# Altium project CMC_400.PrjPcb
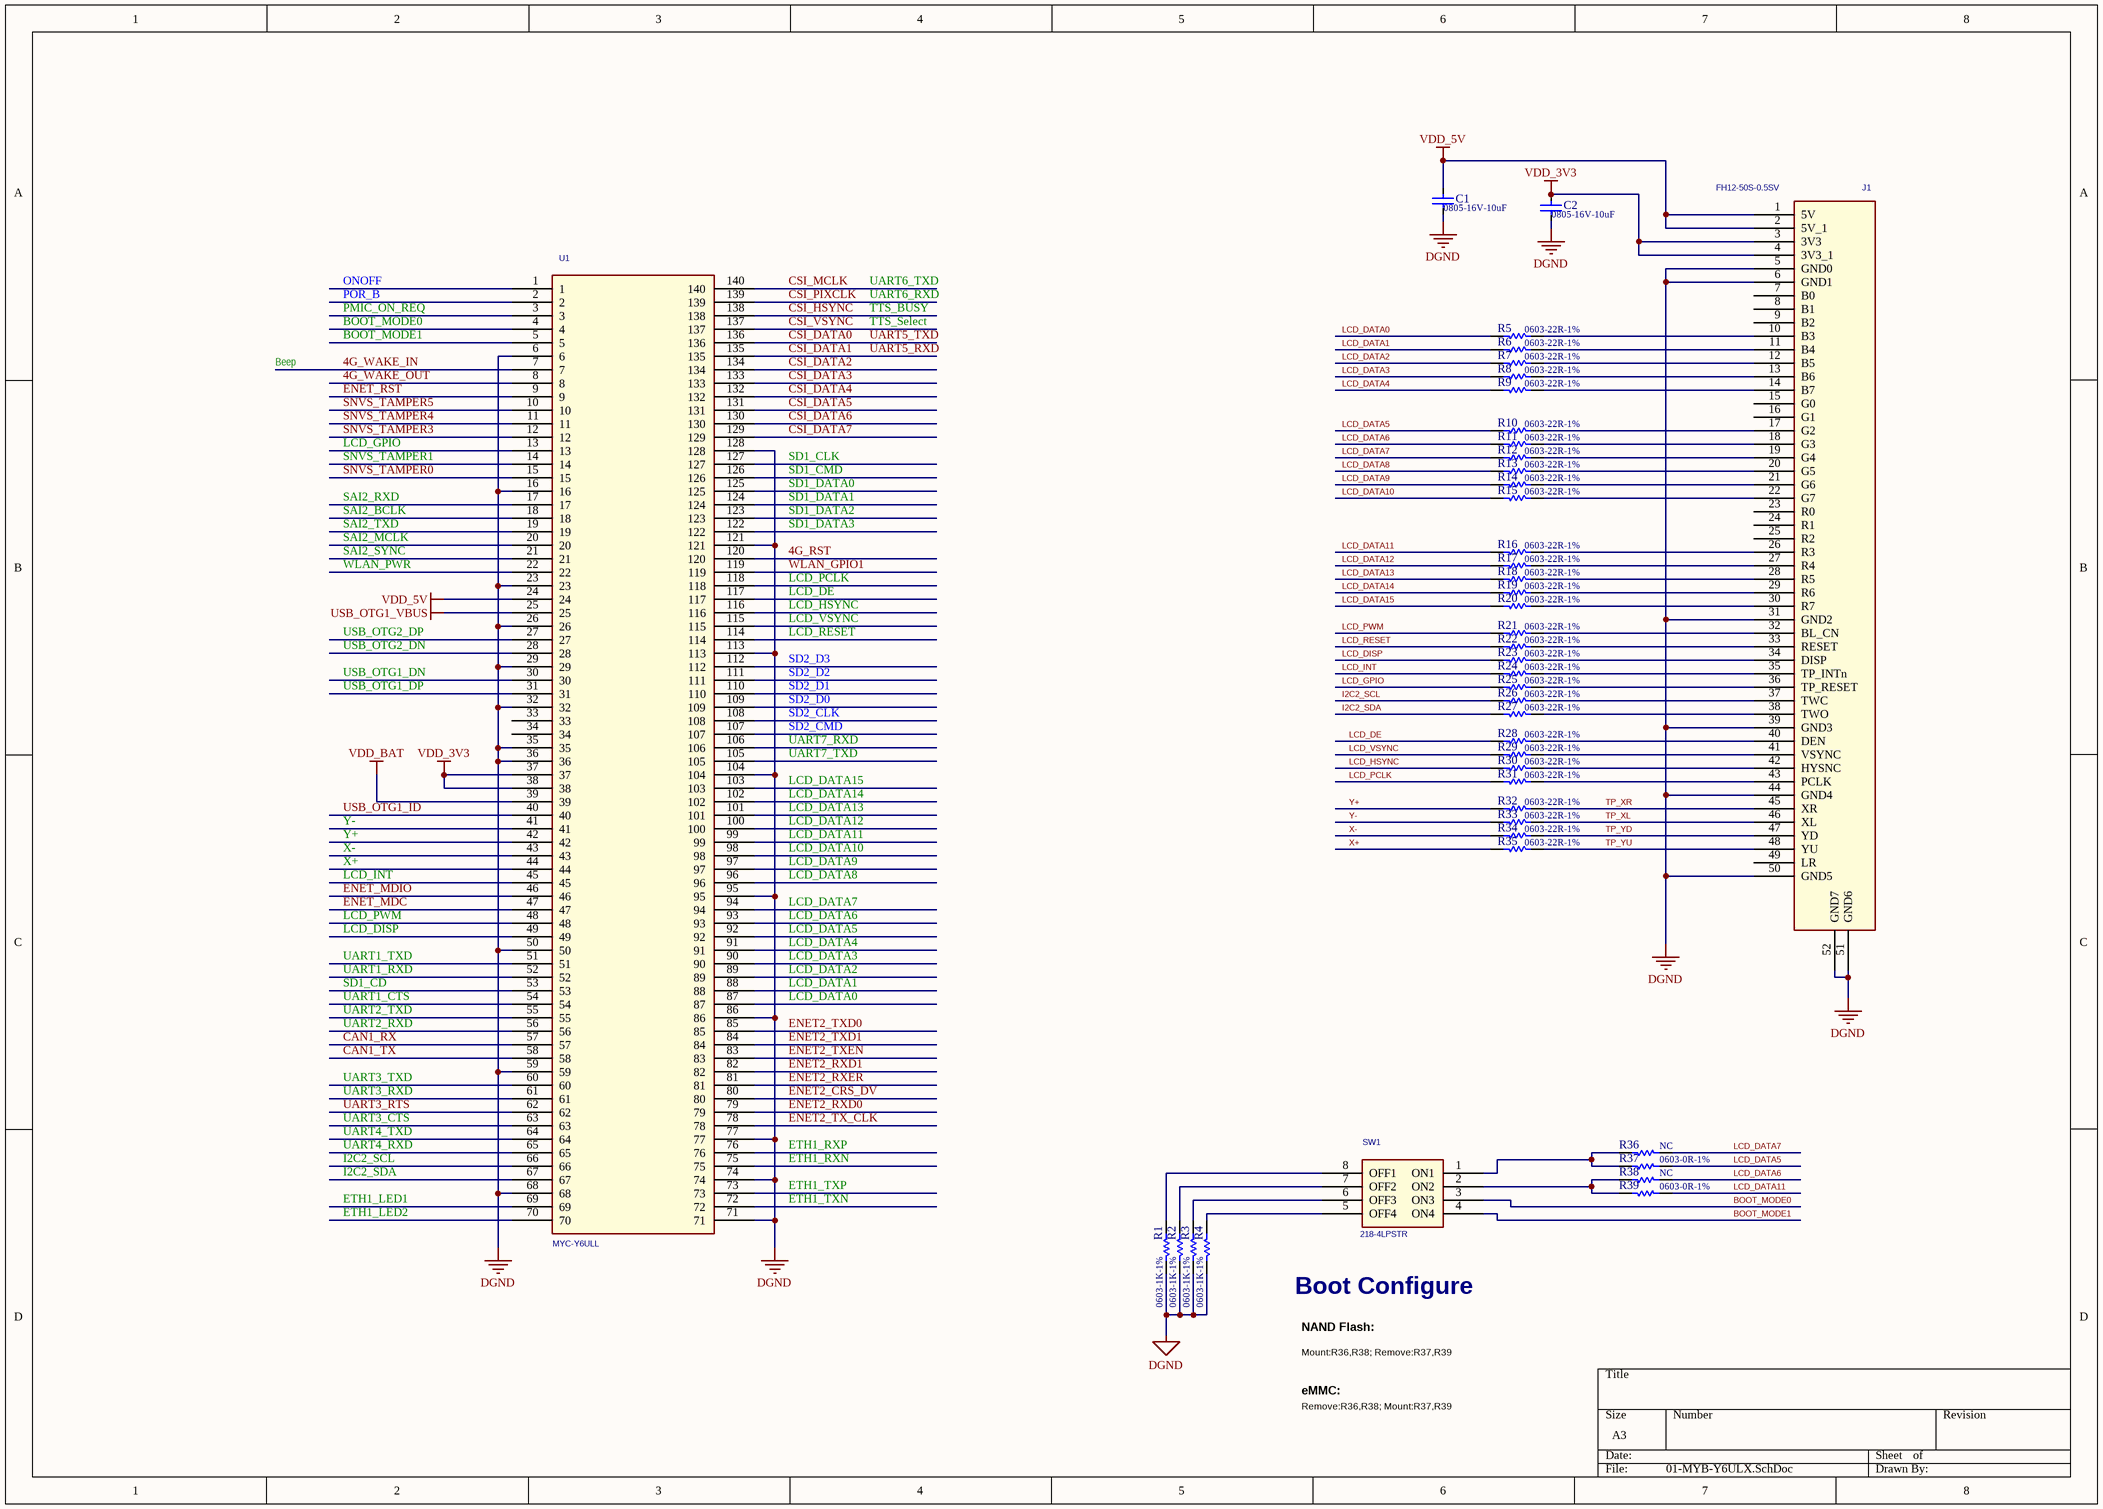
[diagram p0: 01-MYB-Y6ULX.SchDoc]
9 sheets, 334 parts. Net scope: global (net labels, ports and power ports of the same name join across sheets).
Sheets:
  01-MYB-Y6ULX.SchDoc
  02-PowerIn.SchDoc
  03-power.SchDoc
  04-MCU.SchDoc
  05-UART.SchDoc
  06-Audio.SchDoc
  07-NET.SchDoc
  08-USB&TF.SchDoc
  09-other.SchDoc

## Sheet 01-MYB-Y6ULX.SchDoc
size A3

### Parts
C1  0805-16V-10uF  [0805C - 3D]
C2  0805-16V-10uF  [0805C - 3D]
J1  FH12-50S-0.5SV  [fpc50-1_0-v]
R1  0603-1K-1%  [0603R]
R2  0603-1K-1%  [0603R]
R3  0603-1K-1%  [0603R]
R4  0603-1K-1%  [0603R]
R5  0603-22R-1%  [0603R]
R6  0603-22R-1%  [0603R]
R7  0603-22R-1%  [0603R]
R8  0603-22R-1%  [0603R]
R9  0603-22R-1%  [0603R]
R10  0603-22R-1%  [0603R]
R11  0603-22R-1%  [0603R]
R12  0603-22R-1%  [0603R]
R13  0603-22R-1%  [0603R]
R14  0603-22R-1%  [0603R]
R15  0603-22R-1%  [0603R]
R16  0603-22R-1%  [0603R]
R17  0603-22R-1%  [0603R]
R18  0603-22R-1%  [0603R]
R19  0603-22R-1%  [0603R]
R20  0603-22R-1%  [0603R]
R21  0603-22R-1%  [0603R]
R22  0603-22R-1%  [0603R]
R23  0603-22R-1%  [0603R]
R24  0603-22R-1%  [0603R]
R25  0603-22R-1%  [0603R]
R26  0603-22R-1%  [0603R]
R27  0603-22R-1%  [0603R]
R28  0603-22R-1%  [0603R]
R29  0603-22R-1%  [0603R]
R30  0603-22R-1%  [0603R]
R31  0603-22R-1%  [0603R]
R32  0603-22R-1%  [0603R]
R33  0603-22R-1%  [0603R]
R34  0603-22R-1%  [0603R]
R35  0603-22R-1%  [0603R]
R36  NC  [0603R]
R37  0603-0R-1%  [0603R]
R38  NC  [0603R]
R39  0603-0R-1%  [0603R]
SW1  218-4LPSTR  [sw-1x4]
U1  MYC-Y6ULL  [YOUPK37X39_1_00-SMD]

### Nets
DGND: C1.2 C2.2 J1.5(GND0) J1.6(GND1) J1.31(GND2) J1.39(GND3) J1.44(GND4) J1.50(GND5) J1.51(GND6) J1.52(GND7) R1.1 R2.1 R3.1 R4.1 U1.6 U1.16 U1.23 U1.26 U1.29 U1.32 U1.35 U1.36 U1.50 U1.59 U1.68 U1.71 U1.74 U1.77 U1.86 U1.95 U1.104 U1.113 U1.121 U1.128
USB_OTG1_VBUS: U1.25
VDD_3V3: C2.1 J1.3(3V3) J1.4(3V3_1) U1.37 U1.38
VDD_5V: C1.1 J1.1(5V) J1.2(5V_1) U1.24
VDD_BAT: U1.39
4G_RST: U1.120
4G_WAKE_IN: U1.7  [also labelled Beep]
4G_WAKE_OUT: U1.8
BOOT_MODE0: SW1.3(ON3) U1.4
BOOT_MODE1: SW1.4(ON4) U1.5
CAN1_RX: U1.57
CAN1_TX: U1.58
CSI_DATA0: U1.136  [also labelled UART5_TXD]
CSI_DATA1: U1.135  [also labelled UART5_RXD]
CSI_DATA2: U1.134
CSI_DATA3: U1.133
CSI_DATA4: U1.132
CSI_DATA5: U1.131
CSI_DATA6: U1.130
CSI_DATA7: U1.129
CSI_HSYNC: U1.138  [also labelled TTS_BUSY]
CSI_MCLK: U1.140  [also labelled UART6_TXD]
CSI_PIXCLK: U1.139  [also labelled UART6_RXD]
CSI_VSYNC: U1.137  [also labelled TTS_Select]
ENET2_CRS_DV: U1.80
ENET2_RXD0: U1.79
ENET2_RXD1: U1.82
ENET2_RXER: U1.81
ENET2_TX_CLK: U1.78
ENET2_TXD0: U1.85
ENET2_TXD1: U1.84
ENET2_TXEN: U1.83
ENET_MDC: U1.47
ENET_MDIO: U1.46
ENET_RST: U1.9
ETH1_LED1: U1.69
ETH1_LED2: U1.70
ETH1_RXN: U1.75
ETH1_RXP: U1.76
ETH1_TXN: U1.72
ETH1_TXP: U1.73
I2C2_SCL: R26.1 U1.66
I2C2_SDA: R27.1 U1.67
LCD_DATA0: R5.1 U1.87
LCD_DATA1: R6.1 U1.88
LCD_DATA2: R7.1 U1.89
LCD_DATA3: R8.1 U1.90
LCD_DATA4: R9.1 U1.91
LCD_DATA5: R10.1 R37.2 U1.92
LCD_DATA6: R11.1 R38.2 U1.93
LCD_DATA7: R12.1 R36.2 U1.94
LCD_DATA8: R13.1 U1.96
LCD_DATA9: R14.1 U1.97
LCD_DATA10: R15.1 U1.98
LCD_DATA11: R16.1 R39.2 U1.99
LCD_DATA12: R17.1 U1.100
LCD_DATA13: R18.1 U1.101
LCD_DATA14: R19.1 U1.102
LCD_DATA15: R20.1 U1.103
LCD_DE: R28.1 U1.117
LCD_DISP: R23.1 U1.49
LCD_GPIO: R25.1 U1.13
LCD_HSYNC: R30.1 U1.116
LCD_INT: R24.1 U1.45
LCD_PCLK: R31.1 U1.118
LCD_PWM: R21.1 U1.48
LCD_RESET: R22.1 U1.114
LCD_VSYNC: R29.1 U1.115
ONOFF: U1.1
PMIC_ON_REQ: U1.3
POR_B: U1.2
SAI2_BCLK: U1.18
SAI2_MCLK: U1.20
SAI2_RXD: U1.17
SAI2_SYNC: U1.21
SAI2_TXD: U1.19
SD1_CD: U1.53
SD1_CLK: U1.127
SD1_CMD: U1.126
SD1_DATA0: U1.125
SD1_DATA1: U1.124
SD1_DATA2: U1.123
SD1_DATA3: U1.122
SD2_CLK: U1.108
SD2_CMD: U1.107
SD2_D0: U1.109
SD2_D1: U1.110
SD2_D2: U1.111
SD2_D3: U1.112
SNVS_TAMPER0: U1.15
SNVS_TAMPER1: U1.14
SNVS_TAMPER3: U1.12
SNVS_TAMPER4: U1.11
SNVS_TAMPER5: U1.10
TP_XL: J1.46(XL) R33.2
TP_XR: J1.45(XR) R32.2
TP_YD: J1.47(YD) R34.2
TP_YU: J1.48(YU) R35.2
UART1_CTS: U1.54
UART1_RXD: U1.52
UART1_TXD: U1.51
UART2_RXD: U1.56
UART2_TXD: U1.55
UART3_CTS: U1.63
UART3_RTS: U1.62
UART3_RXD: U1.61
UART3_TXD: U1.60
UART4_RXD: U1.65
UART4_TXD: U1.64
UART7_RXD: U1.106  [project net MCU_TX]
UART7_TXD: U1.105  [project net MCU_RX]
USB_OTG1_DN: U1.30
USB_OTG1_DP: U1.31
USB_OTG1_ID: U1.40
USB_OTG2_DN: U1.28
USB_OTG2_DP: U1.27
WLAN_GPIO1: U1.119
WLAN_PWR: U1.22
X+: R35.1 U1.44
X-: R34.1 U1.43
Y+: R32.1 U1.42
Y-: R33.1 U1.41
NetJ1_10: J1.10(B3) R5.2
NetJ1_11: J1.11(B4) R6.2
NetJ1_12: J1.12(B5) R7.2
NetJ1_13: J1.13(B6) R8.2
NetJ1_14: J1.14(B7) R9.2
NetJ1_17: J1.17(G2) R10.2
NetJ1_18: J1.18(G3) R11.2
NetJ1_19: J1.19(G4) R12.2
NetJ1_20: J1.20(G5) R13.2
NetJ1_21: J1.21(G6) R14.2
NetJ1_22: J1.22(G7) R15.2
NetJ1_26: J1.26(R3) R16.2
NetJ1_27: J1.27(R4) R17.2
NetJ1_28: J1.28(R5) R18.2
NetJ1_29: J1.29(R6) R19.2
NetJ1_30: J1.30(R7) R20.2
NetJ1_32: J1.32(BL_CN) R21.2
NetJ1_33: J1.33(RESET) R22.2
NetJ1_34: J1.34(DISP) R23.2
NetJ1_35: J1.35(TP_INTn) R24.2
NetJ1_36: J1.36(TP_RESET) R25.2
NetJ1_37: J1.37(TWC) R26.2
NetJ1_38: J1.38(TWO) R27.2
NetJ1_40: J1.40(DEN) R28.2
NetJ1_41: J1.41(VSYNC) R29.2
NetJ1_42: J1.42(HYSNC) R30.2
NetJ1_43: J1.43(PCLK) R31.2
NetR1_2: R1.2 SW1.8(OFF1)
NetR2_2: R2.2 SW1.7(OFF2)
NetR3_2: R3.2 SW1.6(OFF3)
NetR4_2: R4.2 SW1.5(OFF4)
NetR36_1: R36.1 R37.1 SW1.1(ON1)
NetR38_1: R38.1 R39.1 SW1.2(ON2)

Not connected (* = marked no-connect by the designer): J1 7(B0) 8(B1) 9(B2) 15(G0) 16(G1) 23(R0) 24(R1) 25(R2) 49(LR); U1 33 34

### Notes on the sheet
- Boot Configure
- eMMC:
- NAND Flash:
- Mount:R36,R38; Remove:R37,R39
- Remove:R36,R38; Mount:R37,R39

### Library data of the parts
C1 C2 = Cap: Capacitor; Value: 10nF; Published: 8-Jun-2000; Revision: July-2002: Re-released for DXP Platform.; Publisher: Altium Limited
J1 = FPC50: FPC Connector,Straight,50Pin,0.5mm Pitch  Flip Vertical  Type ,2MM Height,Tin Plated, white,SMD; Manufacturer: HRS; Myir P/N: 2110600006; Datasheet: FH12_30s-fpc.pdf; Reserve Value: FH12-50S-0.5SV; Manufacturer P/N: FH12-50S-0.5SV; Part Type: Connector
R1-R35 R37 R39 = Res1: Resistor; Value: 1K; Published: 8-Jun-2000; LatestRevisionDate: 17-Jul-2002; LatestRevisionNote: Re-released for DXP Platform.; PackageReference: AXIAL-0.3; Publisher: Altium Limited
R36 R38 = Res1: Resistor; Value: 0603-0R-1%; Published: 8-Jun-2000; LatestRevisionDate: 17-Jul-2002; LatestRevisionNote: Re-released for DXP Platform.; PackageReference: AXIAL-0.3; Publisher: Altium Limited
SW1 = SWITCH-4: Switch, Dip Switches SPST 4 switch sections,4 Position,1.27MM Pitch,black housing,white plunger,SMD,CTS; Myir P/N: 2120300002; Datasheet: 218-786217.pdf; Reserve Value: 218-4LPSTR; Manufacturer P/N: 218-4LPSTR; Manufacturer: CTS; Part Type: Switch
U1 = AM335X_QFN_2

## Sheet 02-PowerIn.SchDoc
size A4
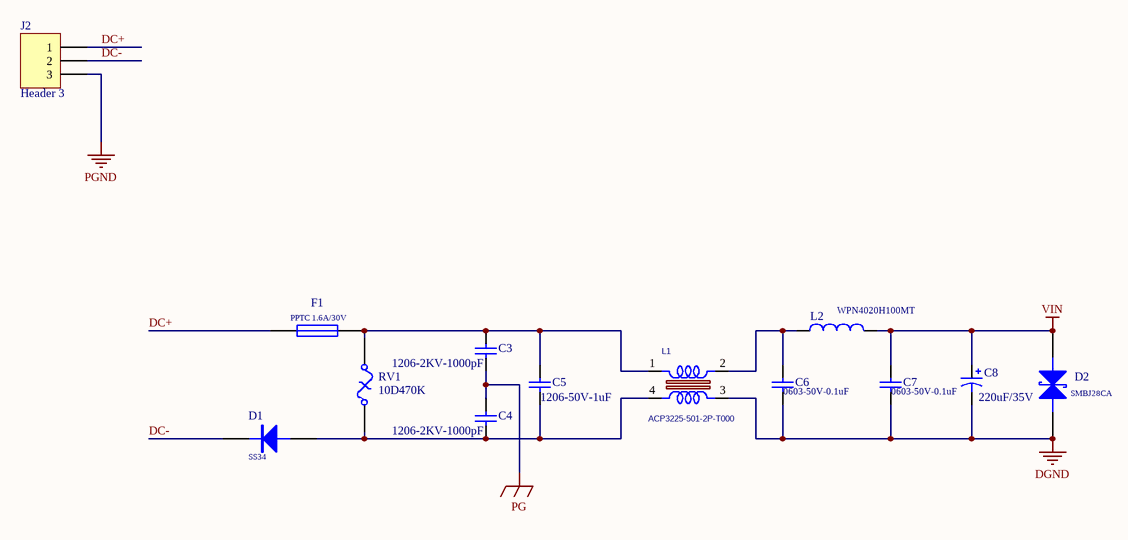
[diagram p1: 02-PowerIn.SchDoc]

### Parts
C3  1206-2KV-1000pF  [1206C]
C4  1206-2KV-1000pF  [1206C]
C5  1206-50V-1uF  [1206C]
C6  0603-50V-0.1uF  [0603C]
C7  0603-50V-0.1uF  [0603C]
C8  value 220uF/35V  [CAP-D8.0XH10.5]  (hidden comment: CK1V221MCRF10)
D1  SS34  [SMA]
D2  SMBJ28CA  [SMB-TVS]
F1  PPTC 1.6A/30V  [F-1.60A-30V]
J2  Header 3  [KF2EDGR-5.08-3P]
L1  ACP3225-501-2P-T000  [1210_4P]
L2  WPN4020H100MT  [4012]
RV1  10D470K  [PS-RES-12.5*5.4]

### Nets
DGND: C6.2 C7.2 C8.2 D2.1(A) L1.3
PG: C3.1 C4.2
PGND: J2.3
VIN: C7.1 C8.1 D2.2(K) L2.2
DC+: F1.2 J2.1
DC-: D1.2 J2.2
NetC3_2: C3.2 C5.2 F1.1 L1.1 RV1.2
NetC4_1: C4.1 C5.1 D1.1 L1.4 RV1.1
NetC6_1: C6.1 L1.2 L2.1

### Library data of the parts
C3-C5 = Cap: Capacitor; Published: 8-Jun-2000; LatestRevisionDate: 17-Jul-2002; LatestRevisionNote: Re-released for DXP Platform.; Publisher: Altium Limited
C6 C7 = Cap: Capacitor; Value: 10nF; Published: 8-Jun-2000; Revision: July-2002: Re-released for DXP Platform.; Publisher: Altium Limited
C8 = Cap Pol1: Polarized Capacitor (Radial); 厂家: ST(先科); 封装: SMD,8x10.5mm; Published: 8-Jun-2000; LatestRevisionDate: 17-Jul-2002; LatestRevisionNote: Re-released for DXP Platform.; PackageReference: RB7.6-15; Publisher: Altium Limited; PackageDescription: Polarized Capacitor (Radial); 2 Leads; 型号: CK1V221MCRF10
D1 = DIODE
D2 = TVSC
F1 = Fuse 1: Fuse; 型号: RL30-160; 厂家: RUILON(瑞隆源); Published: 8-Jun-2000; LatestRevisionDate: 17-Jul-2002; LatestRevisionNote: Re-released for DXP Platform.; PackageReference: PIN-W2/E2.8; Publisher: Altium Limited; PackageDescription: Thru-Hole; 2 Leads
J2 = Header 3: Header, 3-Pin; LatestRevisionDate: 17-Jul-2002; LatestRevisionNote: Re-released for DXP Platform.; Publisher: Altium Limited
L1 = Common Choke: Inductor, TDK,500ohm@100MHz,±25%,2A ,0.4ohm; Manufacturer: Sunlord; Manufacturer P/N: SDCW2012-2-121TF; Mfg2_PN: EXC-24CE201U; DNP: No; Device: 0504CHOKE; Mfg1_PN: DLP11SN900SL2; Dist1: Mouser; Mfg1: Murata; Dist1_PN: 81-DLP11SN900SL2L; Cost_1K: 0.26; Cost_100: 0.32; Myir P/N: 2050400001; Reserve Value: 120ohm; Mfg2: Panasonic; Cost: 0.56; Part Type: Common Inductor; Datasheet: SDCW2012-2.pdf
L2 = Inductor: 贴片功率电感; Code_IEC: 1005; Published: 8-Jun-2000; LatestRevisionDate: 29-May-2009; LatestRevisionNote: IPC-7351 Footprint Added.; PackageReference: 0402-A; Publisher: Altium Limited; PackageDescription: Chip Inductor; Code_JEITA: 0402
RV1 = Fuse Thermal: Thermal Fuse; Published: 24-Mar-1999; LatestRevisionDate: 17-Jul-2002; LatestRevisionNote: Re-released for DXP Platform.; PackageReference: PIN-W2/E2.8; Publisher: Altium Limited; PackageDescription: Thru-Hole; 2 Leads

## Sheet 03-power.SchDoc
size A4
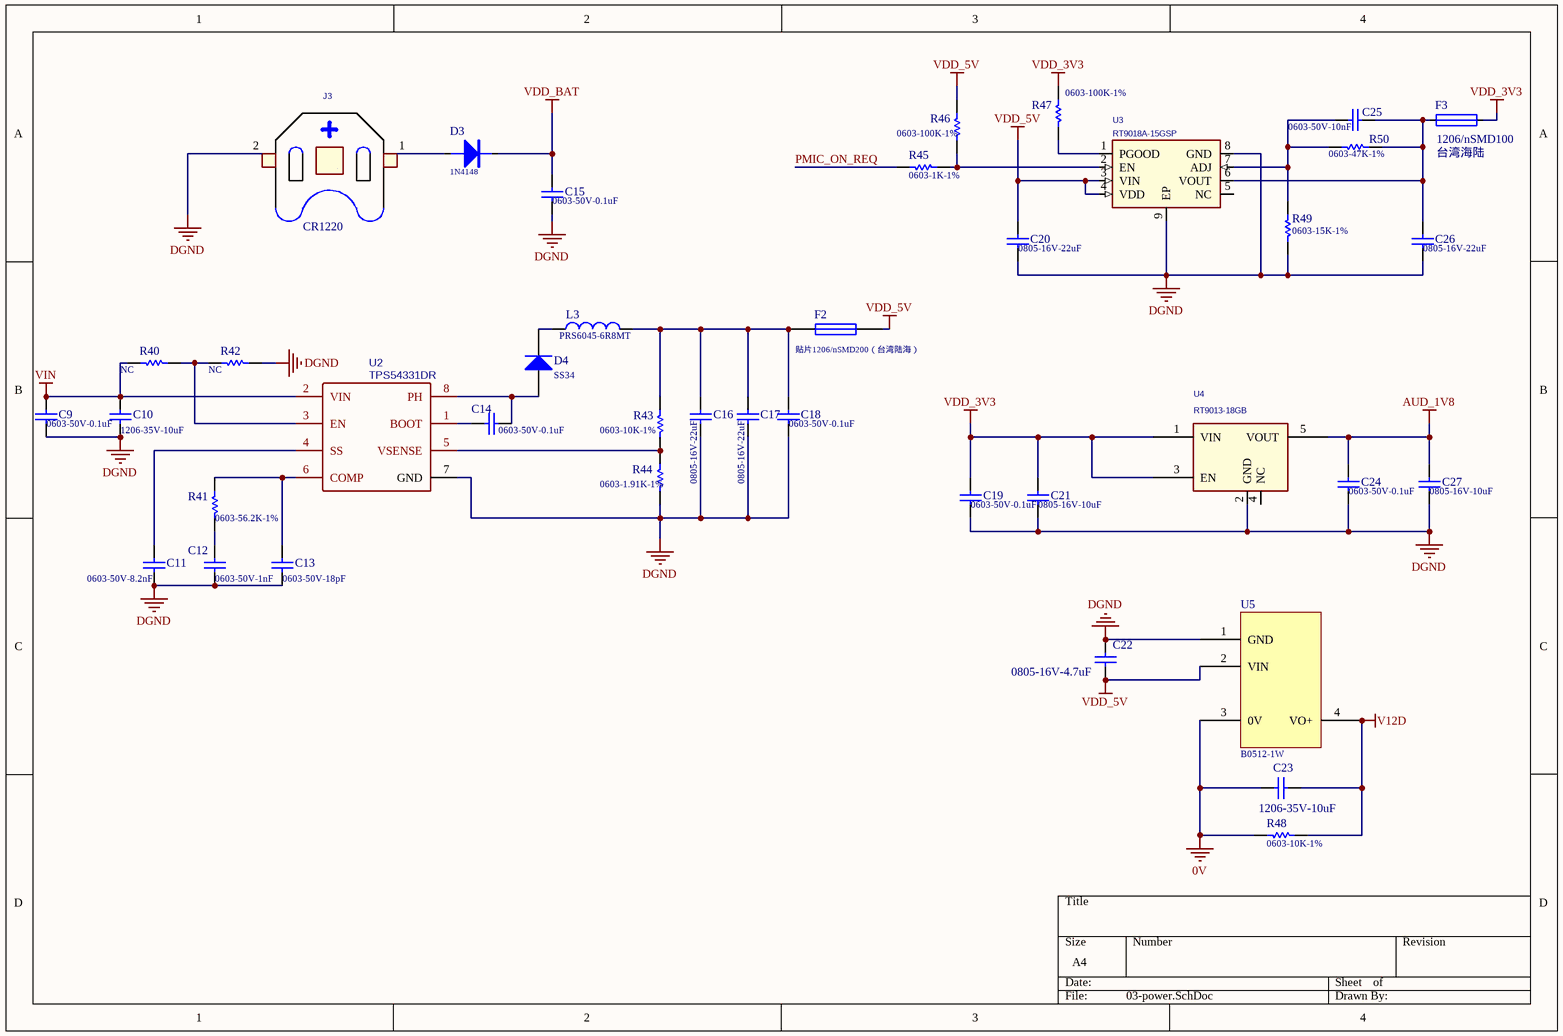
[diagram p2: 03-power.SchDoc]

### Parts
C9  0603-50V-0.1uF  [0603C]
C10  1206-35V-10uF  [1206C]
C11  0603-50V-8.2nF  [0603C]
C12  0603-50V-1nF  [0603C]
C13  0603-50V-18pF  [0603C]
C14  0603-50V-0.1uF  [0603C]
C15  0603-50V-0.1uF  [0603C]
C16  0805-16V-22uF  [0805C]
C17  0805-16V-22uF  [0805C]
C18  0603-50V-0.1uF  [0603C]
C19  0603-50V-0.1uF  [0603C]
C20  0805-16V-22uF  [0805C]
C21  0805-16V-10uF  [0805C]
C22  0805-16V-4.7uF  [1206C]
C23  1206-35V-10uF  [1206C]
C24  0603-50V-0.1uF  [0603C]
C25  0603-50V-10nF  [0603C]
C26  0805-16V-22uF  [0805C]
C27  0805-16V-10uF  [0805C]
D3  1N4148  [SOD-323]
D4  SS34  [SMA]
F2  贴片1206/nSMD200（台湾陆海）  [1206F]
F3  1206/nSMD100  厂家: 台湾海陆  [1206F]
J3  CR1220  [CR1220]
L3  PRS6045-6R8MT  [SCDS125T 12.5*12.5]
R40  NC  [0603R]
R41  0603-56.2K-1%  [0603R]
R42  NC  [0603R]
R43  0603-10K-1%  [0603R]
R44  0603-1.91K-1%  [0603R]
R45  0603-1K-1%  [0603R]
R46  0603-100K-1%  [0603R]
R47  0603-100K-1%  [0603R]
R48  0603-10K-1%  [0603R]
R49  0603-15K-1%  [0603R]
R50  0603-47K-1%  [0603R]
U2  TPS54331DR  [LC-SOIC-8_150mil]
U3  RT9018A-15GSP  [LC-SOP-8_EP_150mil]
U4  RT9013-18GB  [SOT-23-5]
U5  B0512-1W  [DIP-11.6X6.0X10.16]

### Nets
0V: C23.2 R48.1 U5.3(0V)
AUD_1V8: C24.1 C27.1 U4.5(VOUT)
DGND: C9.2 C10.2 C11.2 C12.2 C13.2 C15.2 C16.2 C17.2 C18.2 C19.2 C20.2 C21.2 C22.2 C24.2 C26.2 C27.2 J3.2(P2) R42.2 R44.2 R49.1 U2.7(GND) U3.8(GND) U3.9(EP) U4.2(GND) U5.1(GND)
V12D: C23.1 R48.2 U5.4(VO+)
VDD_3V3: C19.1 C21.1 F3.1 R47.1 U4.1(VIN) U4.3(EN)
VDD_5V: C20.1 C22.1 F2.2 R46.1 U3.3(VIN) U3.4(VDD) U5.2(VIN)
VDD_BAT: C15.1 D3.2
VIN: C9.1 C10.1 R40.1 U2.2(VIN)
PMIC_ON_REQ: R45.1
NetC11_1: C11.1 U2.4(SS)
NetC12_1: C12.1 R41.2
NetC13_1: C13.1 R41.1 U2.6(COMP)
NetC14_1: C14.1 D4.1(A) U2.8(PH)
NetC14_2: C14.2 U2.1(BOOT)
NetC16_1: C16.1 C17.1 C18.1 F2.1 L3.2 R43.1
NetC25_1: C25.1 R49.2 R50.1 U3.7(ADJ)
NetC25_2: C25.2 C26.1 F3.2 R50.2 U3.6(VOUT)
NetD3_1: D3.1 J3.1(P1)
NetD4_2: D4.2(K) L3.1
NetR40_2: R40.2 R42.1 U2.3(EN)
NetR43_2: R43.2 R44.1 U2.5(VSENSE)
NetR45_2: R45.2 R46.2 U3.2(EN)
NetR47_2: R47.2 U3.1(PGOOD)

Not connected (* = marked no-connect by the designer): U3 5(NC); U4 4(NC)

### Library data of the parts
C9-C21 C24-C27 = Cap: Capacitor; Value: 10nF; Published: 8-Jun-2000; Revision: July-2002: Re-released for DXP Platform.; Publisher: Altium Limited
C22 = Cap: Capacitor; Value: 2.2u; Published: 8-Jun-2000; LatestRevisionDate: 17-Jul-2002; LatestRevisionNote: Re-released for DXP Platform.; PackageReference: RAD-0.3; Publisher: Altium Limited; PackageDescription: Radial Cap, Thru-Hole; 2 Leads; 0.3 in Pin Spacing
C23 = Cap: Capacitor; Value: 4.7u; Published: 8-Jun-2000; LatestRevisionDate: 17-Jul-2002; LatestRevisionNote: Re-released for DXP Platform.; PackageReference: RAD-0.3; Publisher: Altium Limited; PackageDescription: Radial Cap, Thru-Hole; 2 Leads; 0.3 in Pin Spacing
D3 = DIODE
D4 = Diode BAS16: Silicon Switching Diode for High-Speed Switching; Note: Pin 2 is not connected and not drawn.; Published: 21-Mar-2003; LatestRevisionDate: 29-May-2009; LatestRevisionNote: IPC-7351 Footprint Added.; DatasheetVersion: Oct-1999; PackageVersion: Sep-2001; PackageReference: SOT-23; Publisher: Altium Limited; PackageDescription: 3-Pin SOT-23 Package 0.95 mm Pitch, 2.5 mm Lead Span; ComponentLink1Description: Manufacturer Link; ComponentLink1URL: http://www.infineon.com/; ComponentLink2Description: Datasheet; ComponentLink2URL: http://www.infineon.com/upload/Document/cmc_upload/documents/012/5331/bas16series.pdf
F2 F3 = Fuse 1: Fuse; Published: 8-Jun-2000; LatestRevisionDate: 17-Jul-2002; LatestRevisionNote: Re-released for DXP Platform.; PackageReference: PIN-W2/E2.8; Publisher: Altium Limited; PackageDescription: Thru-Hole; 2 Leads
J3 = BatteryHolder_1225: Connector,Battery Holder for 1225,Brown,SMD; Manufacturer: Leyconn; Manufacturer P/N: 469123330020; Myir P/N: 2111900002; Part Type: Connector; Reserve Value: CR1220; Datasheet: 469123-BatteryHolder_1225.pdf
L3 = Inductor: 贴片功率电感; Code_IEC: 1005; Published: 8-Jun-2000; LatestRevisionDate: 29-May-2009; LatestRevisionNote: IPC-7351 Footprint Added.; PackageReference: 0402-A; Publisher: Altium Limited; PackageDescription: Chip Inductor; Code_JEITA: 0402
R40 = Res1: Resistor; Value: 332K; Published: 8-Jun-2000; LatestRevisionDate: 17-Jul-2002; LatestRevisionNote: Re-released for DXP Platform.; PackageReference: AXIAL-0.3; Publisher: Altium Limited
R41 R43-R50 = Res1: Resistor; Value: 1K; Published: 8-Jun-2000; LatestRevisionDate: 17-Jul-2002; LatestRevisionNote: Re-released for DXP Platform.; PackageReference: AXIAL-0.3; Publisher: Altium Limited
R42 = Res1: Resistor; Value: 68.1K; Published: 8-Jun-2000; LatestRevisionDate: 17-Jul-2002; LatestRevisionNote: Re-released for DXP Platform.; PackageReference: AXIAL-0.3; Publisher: Altium Limited
U2 = (no symbol name): BOM_Manufacturer: TI; BOM_Supplier: LCSC; BOM_Manufacturer Part: TPS54331DR; BOM_LCSC Assembly: Yes; image: //image.lceda.cn/szlcsc/C9865.jpg; BOM_Supplier Part: C9865; spicePre: U
U3 = RT9018B: IC, Maximum 3A, Ultra Low Dropout Regulator 8SOP; Manufacturer: Richtek; Manufacturer P/N: RT9018A-18GSP; Myir P/N: 2010300061; Part Type: Power Management; Reserve Value: RT9018A-18GSP; Datasheet: RT9018.pdf
U4 = RT9013-18GB: IC, REG LDO 1.8V 0.5A SOT23-5; Manufacturer: Richtek; Myir P/N: 2010300012; Part Type: Power Management; Manufacturer P/N: RT9013-18GB; Reserve Value: RT9013-18GB; Datasheet: RT9013.pdf
U5 = F1212XT-1WR2: 隔离电源; 型号: B0512S-1W; 厂家: 清远市特斯拉电子科技有限公司; 替带产品: 金升阳  B0512S-1W

## Sheet 04-MCU.SchDoc
size A3
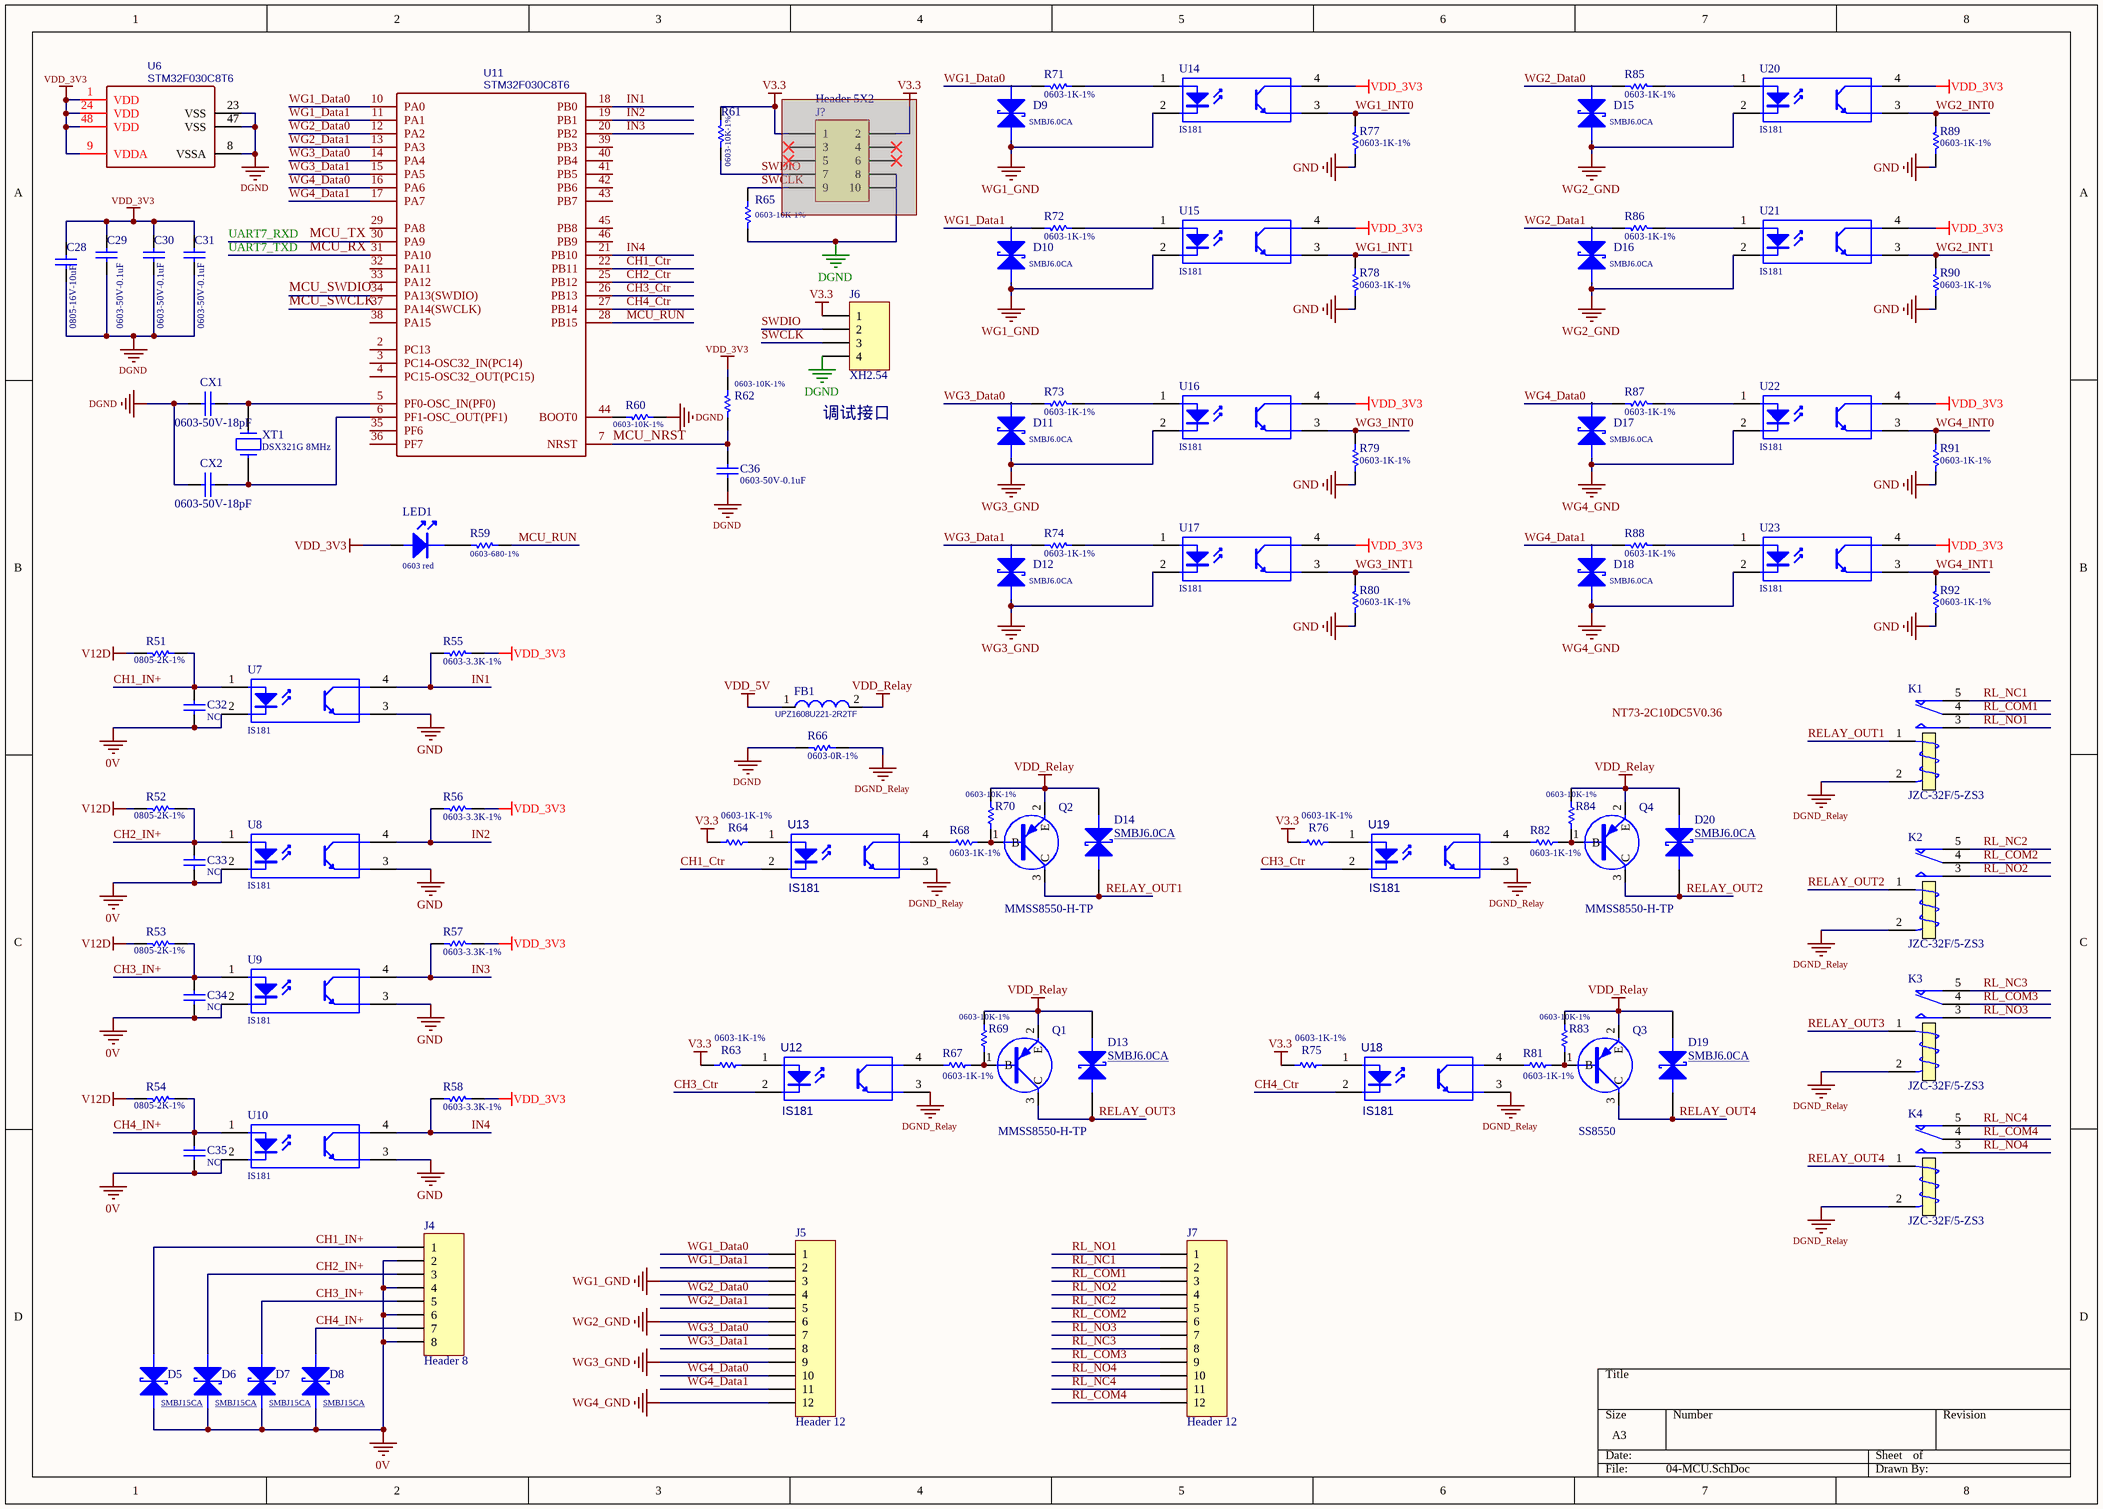
[diagram p3: 04-MCU.SchDoc]

### Parts
C28  0805-16V-10uF  [0805C]
C29  0603-50V-0.1uF  [0603C]
C30  0603-50V-0.1uF  [0603C]
C31  0603-50V-0.1uF  [0603C]
C32  NC  [0603C]
C33  NC  [0603C]
C34  NC  [0603C]
C35  NC  [0603C]
C36  0603-50V-0.1uF  [0603C]
CX1  0603-50V-18pF  [0603C]
CX2  0603-50V-18pF  [0603C]
D5  SMBJ15CA  [SMB-TVS]
D6  SMBJ15CA  [SMB-TVS]
D7  SMBJ15CA  [SMB-TVS]
D8  SMBJ15CA  [SMB-TVS]
D9  SMBJ6.0CA  [SMB-TVS]
D10  SMBJ6.0CA  [SMB-TVS]
D11  SMBJ6.0CA  [SMB-TVS]
D12  SMBJ6.0CA  [SMB-TVS]
D13  SMBJ6.0CA  [SMB-TVS]
D14  SMBJ6.0CA  [SMB-TVS]
D15  SMBJ6.0CA  [SMB-TVS]
D16  SMBJ6.0CA  [SMB-TVS]
D17  SMBJ6.0CA  [SMB-TVS]
D18  SMBJ6.0CA  [SMB-TVS]
D19  SMBJ6.0CA  [SMB-TVS]
D20  SMBJ6.0CA  [SMB-TVS]
FB1  UPZ1608U221-2R2TF  [0603L]
J4  Header 8  [KF2EDGR-5.08-8P]
J5  Header 12  [KF2EDGR-5.08-12P]
J6  XH2.54  [HDR1X4]
J7  Header 12  [KF2EDGR-5.08-12P]
J?  Header 5X2  [IDC-10-B]  (masked out: inside a compile mask, not in the netlist)
K1  JZC-32F/5-ZS3  [RELAY-HF_28]
K2  JZC-32F/5-ZS3  [RELAY-HF_28]
K3  JZC-32F/5-ZS3  [RELAY-HF_28]
K4  JZC-32F/5-ZS3  [RELAY-HF_28]
LED1  0603 red  [LED_1]
Q1  MMSS8550-H-TP  [SOT-23]
Q2  MMSS8550-H-TP  [SOT-23]
Q3  SS8550  [SOT-23]
Q4  MMSS8550-H-TP  [SOT-23]
R51  0805-2K-1%  [0805R]
R52  0805-2K-1%  [0805R]
R53  0805-2K-1%  [0805R]
R54  0805-2K-1%  [0805R]
R55  0603-3.3K-1%  [0603R]
R56  0603-3.3K-1%  [0603R]
R57  0603-3.3K-1%  [0603R]
R58  0603-3.3K-1%  [0603R]
R59  0603-680-1%  [0603R]
R60  0603-10K-1%  [0603R]
R61  0603-10K-1%  [0603R]
R62  0603-10K-1%  [0603R]
R63  0603-1K-1%  [0603R]
R64  0603-1K-1%  [0603R]
R65  0603-10K-1%  [0603R]
R66  0603-0R-1%  [0603R]
R67  0603-1K-1%  [0603R]
R68  0603-1K-1%  [0603R]
R69  0603-10K-1%  [0603R]
R70  0603-10K-1%  [0603R]
R71  0603-1K-1%  [0603R]
R72  0603-1K-1%  [0603R]
R73  0603-1K-1%  [0603R]
R74  0603-1K-1%  [0603R]
R75  0603-1K-1%  [0603R]
R76  0603-1K-1%  [0603R]
R77  0603-1K-1%  [0603R]
R78  0603-1K-1%  [0603R]
R79  0603-1K-1%  [0603R]
R80  0603-1K-1%  [0603R]
R81  0603-1K-1%  [0603R]
R82  0603-1K-1%  [0603R]
R83  0603-10K-1%  [0603R]
R84  0603-10K-1%  [0603R]
R85  0603-1K-1%  [0603R]
R86  0603-1K-1%  [0603R]
R87  0603-1K-1%  [0603R]
R88  0603-1K-1%  [0603R]
R89  0603-1K-1%  [0603R]
R90  0603-1K-1%  [0603R]
R91  0603-1K-1%  [0603R]
R92  0603-1K-1%  [0603R]
U6  STM32F030C8T6  [LQFP-48_7X7X05P]
U7  IS181  [SO-4-2.54]
U8  IS181  [SO-4-2.54]
U9  IS181  [SO-4-2.54]
U10  IS181  [SO-4-2.54]
U11  STM32F030C8T6  [LC-LQFP-48_7x7x05P]
U12  IS181  [SO-4-2.54]
U13  IS181  [SO-4-2.54]
U14  IS181  [SO-4-2.54]
U15  IS181  [SO-4-2.54]
U16  IS181  [SO-4-2.54]
U17  IS181  [SO-4-2.54]
U18  IS181  [SO-4-2.54]
U19  IS181  [SO-4-2.54]
U20  IS181  [SO-4-2.54]
U21  IS181  [SO-4-2.54]
U22  IS181  [SO-4-2.54]
U23  IS181  [SO-4-2.54]
XT1  DSX321G 8MHz  [LC-SMD-3225_4P]

### Nets
0V: C32.2 C33.2 C34.2 C35.2 D5.1(A) D6.1(A) D7.1(A) D8.1(A) J4.2 J4.4 J4.6 J4.8 U7.2(K) U8.2(K) U9.2(K) U10.2(K)
DGND: C28.2 C29.2 C30.2 C31.2 C36.2 CX1.1 CX2.1 J6.4 R60.1 R65.1 R66.1 U6.8(VSSA) U6.23(VSS) U6.47(VSS) XT1.2 XT1.4
DGND_Relay: K1.2(T2) K2.2(T2) K3.2(T2) K4.2(T2) R66.2 U12.3(C) U13.3(C) U18.3(C) U19.3(C)
GND: R77.2 R78.2 R79.2 R80.2 R89.2 R90.2 R91.2 R92.2 U7.3(E) U8.3(E) U9.3(E) U10.3(E)
V3.3: J6.1 R61.2 R63.1 R64.1 R75.1 R76.1
V12D: R51.2 R52.2 R53.2 R54.2
VDD_3V3: C28.1 C29.1 C30.1 C31.1 LED1.1 R55.2 R56.2 R57.2 R58.2 R62.2 U6.1(VDD) U6.9(VDDA) U6.24(VDD) U6.48(VDD) U14.4(C) U15.4(C) U16.4(C) U17.4(C) U20.4(C) U21.4(C) U22.4(C) U23.4(C)
VDD_5V: FB1.1
VDD_Relay: D13.1(A) D14.1(A) D19.1(A) D20.1(A) FB1.2 Q1.2(E) Q2.2(E) Q3.2(E) Q4.2(E) R69.2 R70.2 R83.2 R84.2
WG1_GND: D9.1(A) D10.1(A) J5.3 U14.2(K) U15.2(K)
WG2_GND: D15.1(A) D16.1(A) J5.6 U20.2(K) U21.2(K)
WG3_GND: D11.1(A) D12.1(A) J5.9 U16.2(K) U17.2(K)
WG4_GND: D17.1(A) D18.1(A) J5.12 U22.2(K) U23.2(K)
CH1_Ctr: U11.22(PB11) U13.2(K)
CH1_IN+: C32.1 D5.2(K) J4.1 R51.1 U7.1(A)
CH2_Ctr: U11.25(PB12)
CH2_IN+: C33.1 D6.2(K) J4.3 R52.1 U8.1(A)
CH3_Ctr: U11.26(PB13) U12.2(K) U19.2(K)
CH3_IN+: C34.1 D7.2(K) J4.5 R53.1 U9.1(A)
CH4_Ctr: U11.27(PB14) U18.2(K)
CH4_IN+: C35.1 D8.2(K) J4.7 R54.1 U10.1(A)
IN1: R55.1 U7.4(C) U11.18(PB0)
IN2: R56.1 U8.4(C) U11.19(PB1)
IN3: R57.1 U9.4(C) U11.20(PB2)
IN4: R58.1 U10.4(C) U11.21(PB10)
MCU_NRST: C36.1 R62.1 U11.7(NRST)
MCU_RUN: R59.1 U11.28(PB15)
MCU_RX: U11.31(PA10)  [also labelled UART7_TXD]
MCU_SWCLK: U11.37(PA14(SWCLK))
MCU_SWDIO: U11.34(PA13(SWDIO))
MCU_TX: U11.30(PA9)  [also labelled UART7_RXD]
RELAY_OUT1: D14.2(K) K1.1(T1) Q2.3(C)
RELAY_OUT2: D20.2(K) K2.1(T1) Q4.3(C)
RELAY_OUT3: D13.2(K) K3.1(T1) Q1.3(C)
RELAY_OUT4: D19.2(K) K4.1(T1) Q3.3(C)
RL_COM1: J7.3 K1.4(COM)
RL_COM2: J7.6 K2.4(COM)
RL_COM3: J7.9 K3.4(COM)
RL_COM4: J7.12 K4.4(COM)
RL_NC1: J7.2 K1.5(NC)
RL_NC2: J7.5 K2.5(NC)
RL_NC3: J7.8 K3.5(NC)
RL_NC4: J7.11 K4.5(NC)
RL_NO1: J7.1 K1.3(NO)
RL_NO2: J7.4 K2.3(NO)
RL_NO3: J7.7 K3.3(NO)
RL_NO4: J7.10 K4.3(NO)
SWCLK: J6.3 R65.2
SWDIO: J6.2 R61.1
WG1_Data0: J5.1 R71.1 U11.10(PA0)
WG1_Data1: J5.2 R72.1 U11.11(PA1)
WG1_INT0: R77.1 U14.3(E)
WG1_INT1: R78.1 U15.3(E)
WG2_Data0: J5.4 R85.1 U11.12(PA2)
WG2_Data1: J5.5 R86.1 U11.13(PA3)
WG2_INT0: R89.1 U20.3(E)
WG2_INT1: R90.1 U21.3(E)
WG3_Data0: J5.7 R73.1 U11.14(PA4)
WG3_Data1: J5.8 R74.1 U11.15(PA5)
WG3_INT0: R79.1 U16.3(E)
WG3_INT1: R80.1 U17.3(E)
WG4_Data0: J5.10 R87.1 U11.16(PA6)
WG4_Data1: J5.11 R88.1 U11.17(PA7)
WG4_INT0: R91.1 U22.3(E)
WG4_INT1: R92.1 U23.3(E)
NetCX1_2: CX1.2 U11.5(PF0-OSC_IN(PF0)) XT1.3
NetCX2_2: CX2.2 U11.6(PF1-OSC_OUT(PF1)) XT1.1
NetLED1_2: LED1.2 R59.2
NetQ1_1: Q1.1(B) R67.2 R69.1
NetQ2_1: Q2.1(B) R68.2 R70.1
NetQ3_1: Q3.1(B) R81.2 R83.1
NetQ4_1: Q4.1(B) R82.2 R84.1
NetR60_2: R60.2 U11.44(BOOT0)
NetR63_2: R63.2 U12.1(A)
NetR64_2: R64.2 U13.1(A)
NetR67_1: R67.1 U12.4(E)
NetR68_1: R68.1 U13.4(E)
NetR71_2: R71.2 U14.1(A)
NetR72_2: R72.2 U15.1(A)
NetR73_2: R73.2 U16.1(A)
NetR74_2: R74.2 U17.1(A)
NetR75_2: R75.2 U18.1(A)
NetR76_2: R76.2 U19.1(A)
NetR81_1: R81.1 U18.4(E)
NetR82_1: R82.1 U19.4(E)
NetR85_2: R85.2 U20.1(A)
NetR86_2: R86.2 U21.1(A)
NetR87_2: R87.2 U22.1(A)
NetR88_2: R88.2 U23.1(A)

Not connected (* = marked no-connect by the designer): D9 2(K); D10 2(K); D11 2(K); D12 2(K); D15 2(K); D16 2(K); D17 2(K); D18 2(K); U11 2(PC13) 3(PC14-OSC32_IN(PC14)) 4(PC15-OSC32_OUT(PC15)) 29(PA8) 32(PA11) 33(PA12) 35(PF6) 36(PF7) 38(PA15) 39(PB3) 40(PB4) 41(PB5) 42(PB6) 43(PB7) 45(PB8) 46(PB9)

### Notes on the sheet
- (near J6) 调试接口
- Labels drawn without touching a wire or pin: NT73-2C10DC5V0.36

### Library data of the parts
C28-C31 C36 = Cap: Capacitor; Value: 10nF; Published: 8-Jun-2000; Revision: July-2002: Re-released for DXP Platform.; Publisher: Altium Limited
C32-C35 = Cap: Capacitor; Value: 0603-50V-0.1uF; Published: 8-Jun-2000; Revision: July-2002: Re-released for DXP Platform.; Publisher: Altium Limited
CX1 CX2 = CAP: Capacitor; Value: 39pF
D5-D20 = TVSC
FB1 = FER_BEAD: CLASS: DISCRETE
J4 = Header 8: Header, 8-Pin; LatestRevisionDate: 17-Jul-2002; LatestRevisionNote: Re-released for DXP Platform.; Publisher: Altium Limited
J5 J7 = Header 12: Header, 12-Pin; LatestRevisionDate: 17-Jul-2002; LatestRevisionNote: Re-released for DXP Platform.; Publisher: Altium Limited
J6 = Header 4: Header, 4-Pin; LatestRevisionDate: 17-Jul-2002; LatestRevisionNote: Re-released for DXP Platform.; Publisher: Altium Limited
J? = Header 5X2: Header, 5-Pin, Dual row; LatestRevisionDate: 17-Jul-2002; LatestRevisionNote: Re-released for DXP Platform.; Publisher: Altium Limited
K1-K4 = Relay: SPDT Relay; Published: 8-Jun-2000; LatestRevisionDate: 17-Jul-2002; LatestRevisionNote: Re-released for DXP Platform.; PackageReference: MODULE5B; Publisher: Altium Limited
LED1 = LED: SY: POW
Q1-Q4 = PNP: PNP Transistor
R51-R58 R71-R74 R77-R80 R85-R92 = Res1: Resistor; Value: 10K; Published: 8-Jun-2000; LatestRevisionDate: 17-Jul-2002; LatestRevisionNote: Re-released for DXP Platform.; PackageReference: AXIAL-0.3; Publisher: Altium Limited
R59-R70 R75 R76 R81-R84 = Res1: Resistor; Value: 1K; Published: 8-Jun-2000; LatestRevisionDate: 17-Jul-2002; LatestRevisionNote: Re-released for DXP Platform.; PackageReference: AXIAL-0.3; Publisher: Altium Limited
U6 = (no symbol name): BOM_Manufacturer: ST; subpart_no: 2; tags: STM32; BOM_Supplier Part: C23922; BOM_Supplier: LCSC; BOM_Manufacturer Part: STM32F030C8T6; image: http://image.lceda.cn/szlcsc/C23922.jpg; spicePre: U
U7-U10 U14-U17 U20-U23 = OPTOISO1: Optoisolator
U11 = (no symbol name): BOM_Manufacturer: STMicroelectronics; BOM_Supplier: LCSC; BOM_Manufacturer Part: STM32F030C8T6; BOM_LCSC Assembly: Yes; image: //image.lceda.cn/szlcsc/C23922.jpg; BOM_Supplier Part: C23922; spicePre: U
U12 U13 U18 U19 = TLP521: 1.06.02.0011
XT1 = CRYSTAL: Value: 8MHz

## Sheet 05-UART.SchDoc
size A4
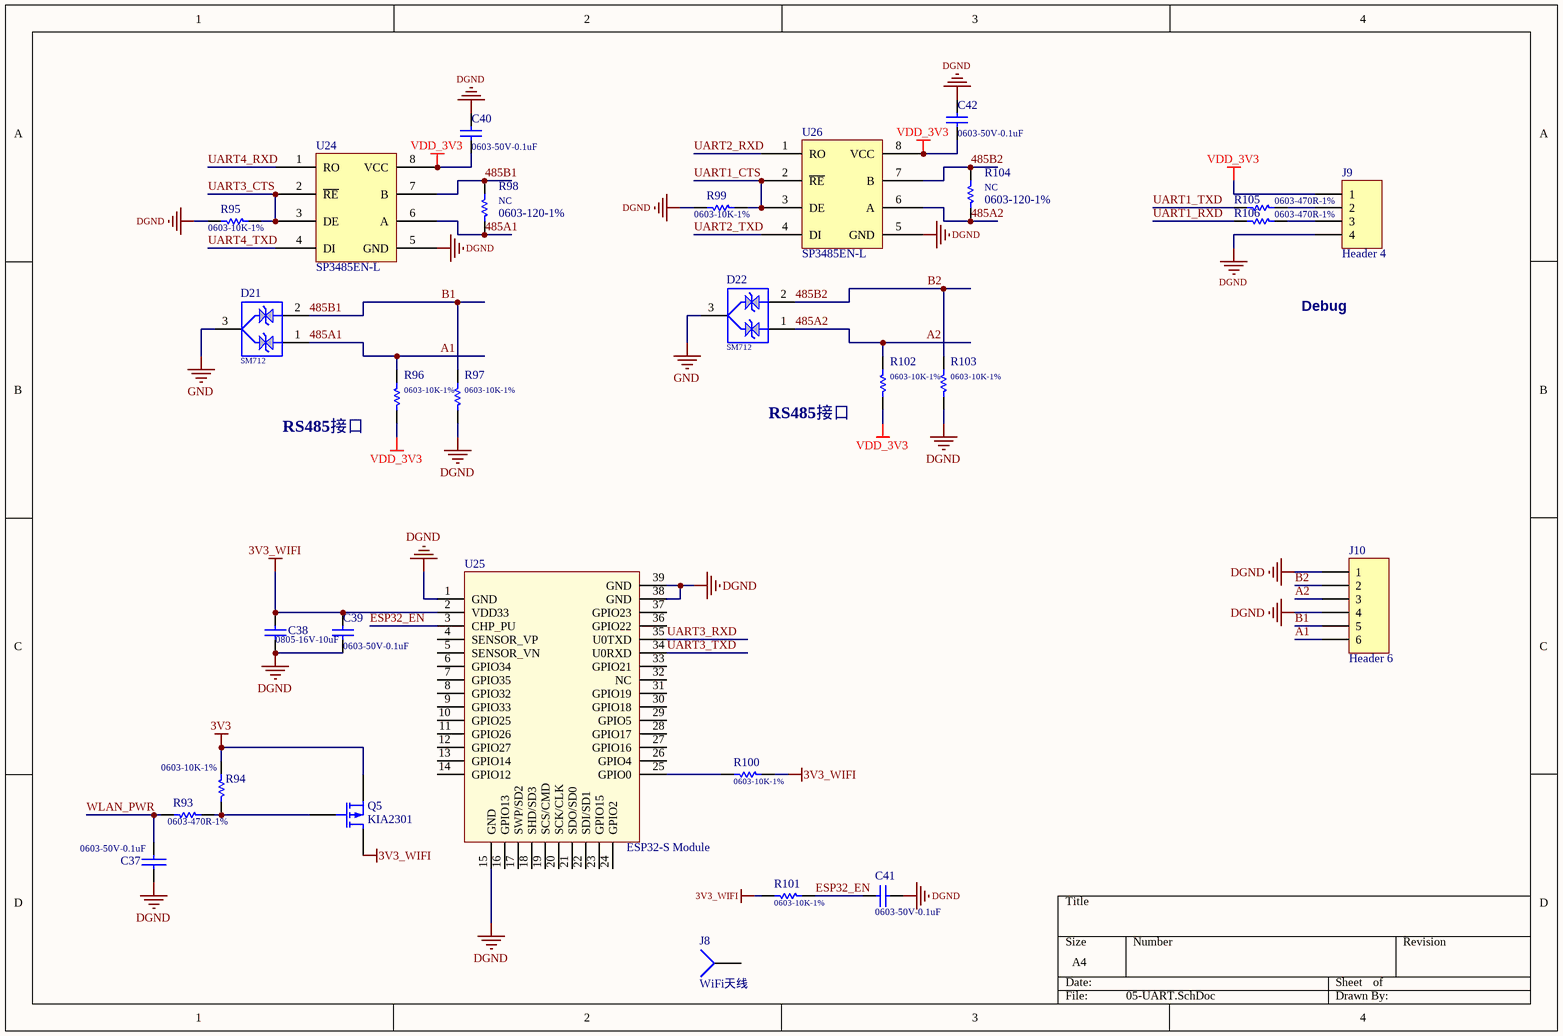
[diagram p4: 05-UART.SchDoc]

### Parts
C37  0603-50V-0.1uF  [0603C]
C38  0805-16V-10uF  [0805C - 3D]
C39  0603-50V-0.1uF  [0603C]
C40  0603-50V-0.1uF  [0603C]
C41  0603-50V-0.1uF  [0603C]
C42  0603-50V-0.1uF  [0603C]
D21  SM712  [SOT-23]
D22  SM712  [SOT-23]
J8  WiFi天线  [SMA-KWE]
J9  Header 4  [HDR1X4]
J10  Header 6  [KF2EDGR-5.08-6P]
Q5  KIA2301  [SOT-23]
R93  0603-470R-1%  [0603R]
R94  0603-10K-1%  [0603R]
R95  0603-10K-1%  [0603R]
R96  0603-10K-1%  [0603R]
R97  0603-10K-1%  [0603R]
R98  NC  value 0603-120-1%  [0603R]
R99  0603-10K-1%  [0603R]
R100  0603-10K-1%  [0603R]
R101  0603-10K-1%  [0603R]
R102  0603-10K-1%  [0603R]
R103  0603-10K-1%  [0603R]
R104  NC  value 0603-120-1%  [0603R]
R105  0603-470R-1%  [0603R]
R106  0603-470R-1%  [0603R]
U24  SP3485EN-L  [LC-SOIC-8_150mil]
U25  ESP32-S Module  [ESP32S]
U26  SP3485EN-L  [LC-SOIC-8_150mil]

### Nets
3V3: Q5.S R94.1
3V3_WIFI: C38.1 C39.1 Q5.D R100.2 R101.2 U25.2(VDD33)
DGND: C37.2 C38.2 C39.2 C40.1 C41.2 C42.1 J9.4 J10.1 J10.4 R95.2 R97.2 R99.2 R103.2 U24.5(GND) U25.1(GND) U25.15(GND) U25.38(GND) U25.39(GND) U26.5(GND)
GND: D21.3 D22.3
VDD_3V3: C40.2 C42.2 J9.1 R96.2 R102.2 U24.8(VCC) U26.8(VCC)
485A1: D21.1 J10.6 R96.1 R98.2 U24.6(A)  [also labelled A1]
485A2: D22.1 J10.3 R102.1 R104.2 U26.6(A)  [also labelled A2]
485B1: D21.2 J10.5 R97.1 R98.1 U24.7(B)  [also labelled B1]
485B2: D22.2 J10.2 R103.1 R104.1 U26.7(B)  [also labelled B2]
ESP32_EN: C41.1 R101.1 U25.3(CHP_PU)
UART1_CTS: R99.1 U26.2(~{RE}) U26.3(DE)
UART1_RXD: R106.2
UART1_TXD: R105.2
UART2_RXD: U26.1(RO)
UART2_TXD: U26.4(DI)
UART3_CTS: R95.1 U24.2(~{RE}) U24.3(DE)
UART3_RXD: U25.35(U0TXD)
UART3_TXD: U25.34(U0RXD)
UART4_RXD: U24.1(RO)
UART4_TXD: U24.4(DI)
WLAN_PWR: C37.1 R93.2
NetJ9_2: J9.2 R105.1
NetJ9_3: J9.3 R106.1
NetQ5_G: Q5.G R93.1 R94.2
NetR100_1: R100.1 U25.25(GPIO0)

Not connected (* = marked no-connect by the designer): J8 1; U25 4(SENSOR_VP) 5(SENSOR_VN) 6(GPIO34) 7(GPIO35) 8(GPIO32) 9(GPIO33) 10(GPIO25) 11(GPIO26) 12(GPIO27) 13(GPIO14) 14(GPIO12) 16(GPIO13) 17(SWP/SD2) 18(SHD/SD3) 19(SCS/CMD) 20(SCK/CLK) 21(SDO/SD0) 22(SDI/SD1) 23(GPIO15) 24(GPIO2) 26(GPIO4) 27(GPIO16) 28(GPIO17) 29(GPIO5) 30(GPIO18) 31(GPIO19) 32(NC) 33(GPIO21) 36(GPIO22) 37(GPIO23)

### Notes on the sheet
- Debug
- RS485接口

### Library data of the parts
C37 = CAP: Capacitor
C38 C41 = Cap: Capacitor; Value: 10nF; Published: 8-Jun-2000; Revision: July-2002: Re-released for DXP Platform.; Publisher: Altium Limited
C39 C40 C42 = Cap: Capacitor; Published: 8-Jun-2000; LatestRevisionDate: 17-Jul-2002; LatestRevisionNote: Re-released for DXP Platform.; PackageReference: RAD-0.3; Publisher: Altium Limited; Value: 0603-50V-0.1UF
D21 D22 = NUP2105L: TVS protect
J8 = Socket: LatestRevisionDate: 17-Jul-2002; LatestRevisionNote: Re-released for DXP Platform.; Publisher: Altium Limited
J9 = Header 4: Header, 4-Pin; LatestRevisionDate: 17-Jul-2002; LatestRevisionNote: Re-released for DXP Platform.; Publisher: Altium Limited
J10 = Header 6: Header, 6-Pin; LatestRevisionDate: 17-Jul-2002; LatestRevisionNote: Re-released for DXP Platform.; Publisher: Altium Limited
Q5 = MOSFET-P: P-Channel MOSFET; PackageDocument: 1995/1996; Published: 8-Jun-2000; LatestRevisionDate: 17-Jul-2002; LatestRevisionNote: Re-released for DXP Platform.; PackageReference: E3; Publisher: Altium Limited
R93 R94 R96 R97 R100-R103 = Res1: Resistor; Value: 1K; Published: 8-Jun-2000; LatestRevisionDate: 17-Jul-2002; LatestRevisionNote: Re-released for DXP Platform.; PackageReference: AXIAL-0.3; Publisher: Altium Limited
R95 R98 R99 R104 = Res1: Resistor; Published: 8-Jun-2000; LatestRevisionDate: 17-Jul-2002; LatestRevisionNote: Re-released for DXP Platform.; PackageReference: AXIAL-0.3; Publisher: Altium Limited
  R95 R99: Value: 0603-10K-1%
R105 R106 = Res1: Resistor; Value: 0603-10K-1%; Published: 8-Jun-2000; LatestRevisionDate: 17-Jul-2002; LatestRevisionNote: Re-released for DXP Platform.; PackageReference: AXIAL-0.3; Publisher: Altium Limited
U24 U26 = MAX485

## Sheet 06-Audio.SchDoc
size A3
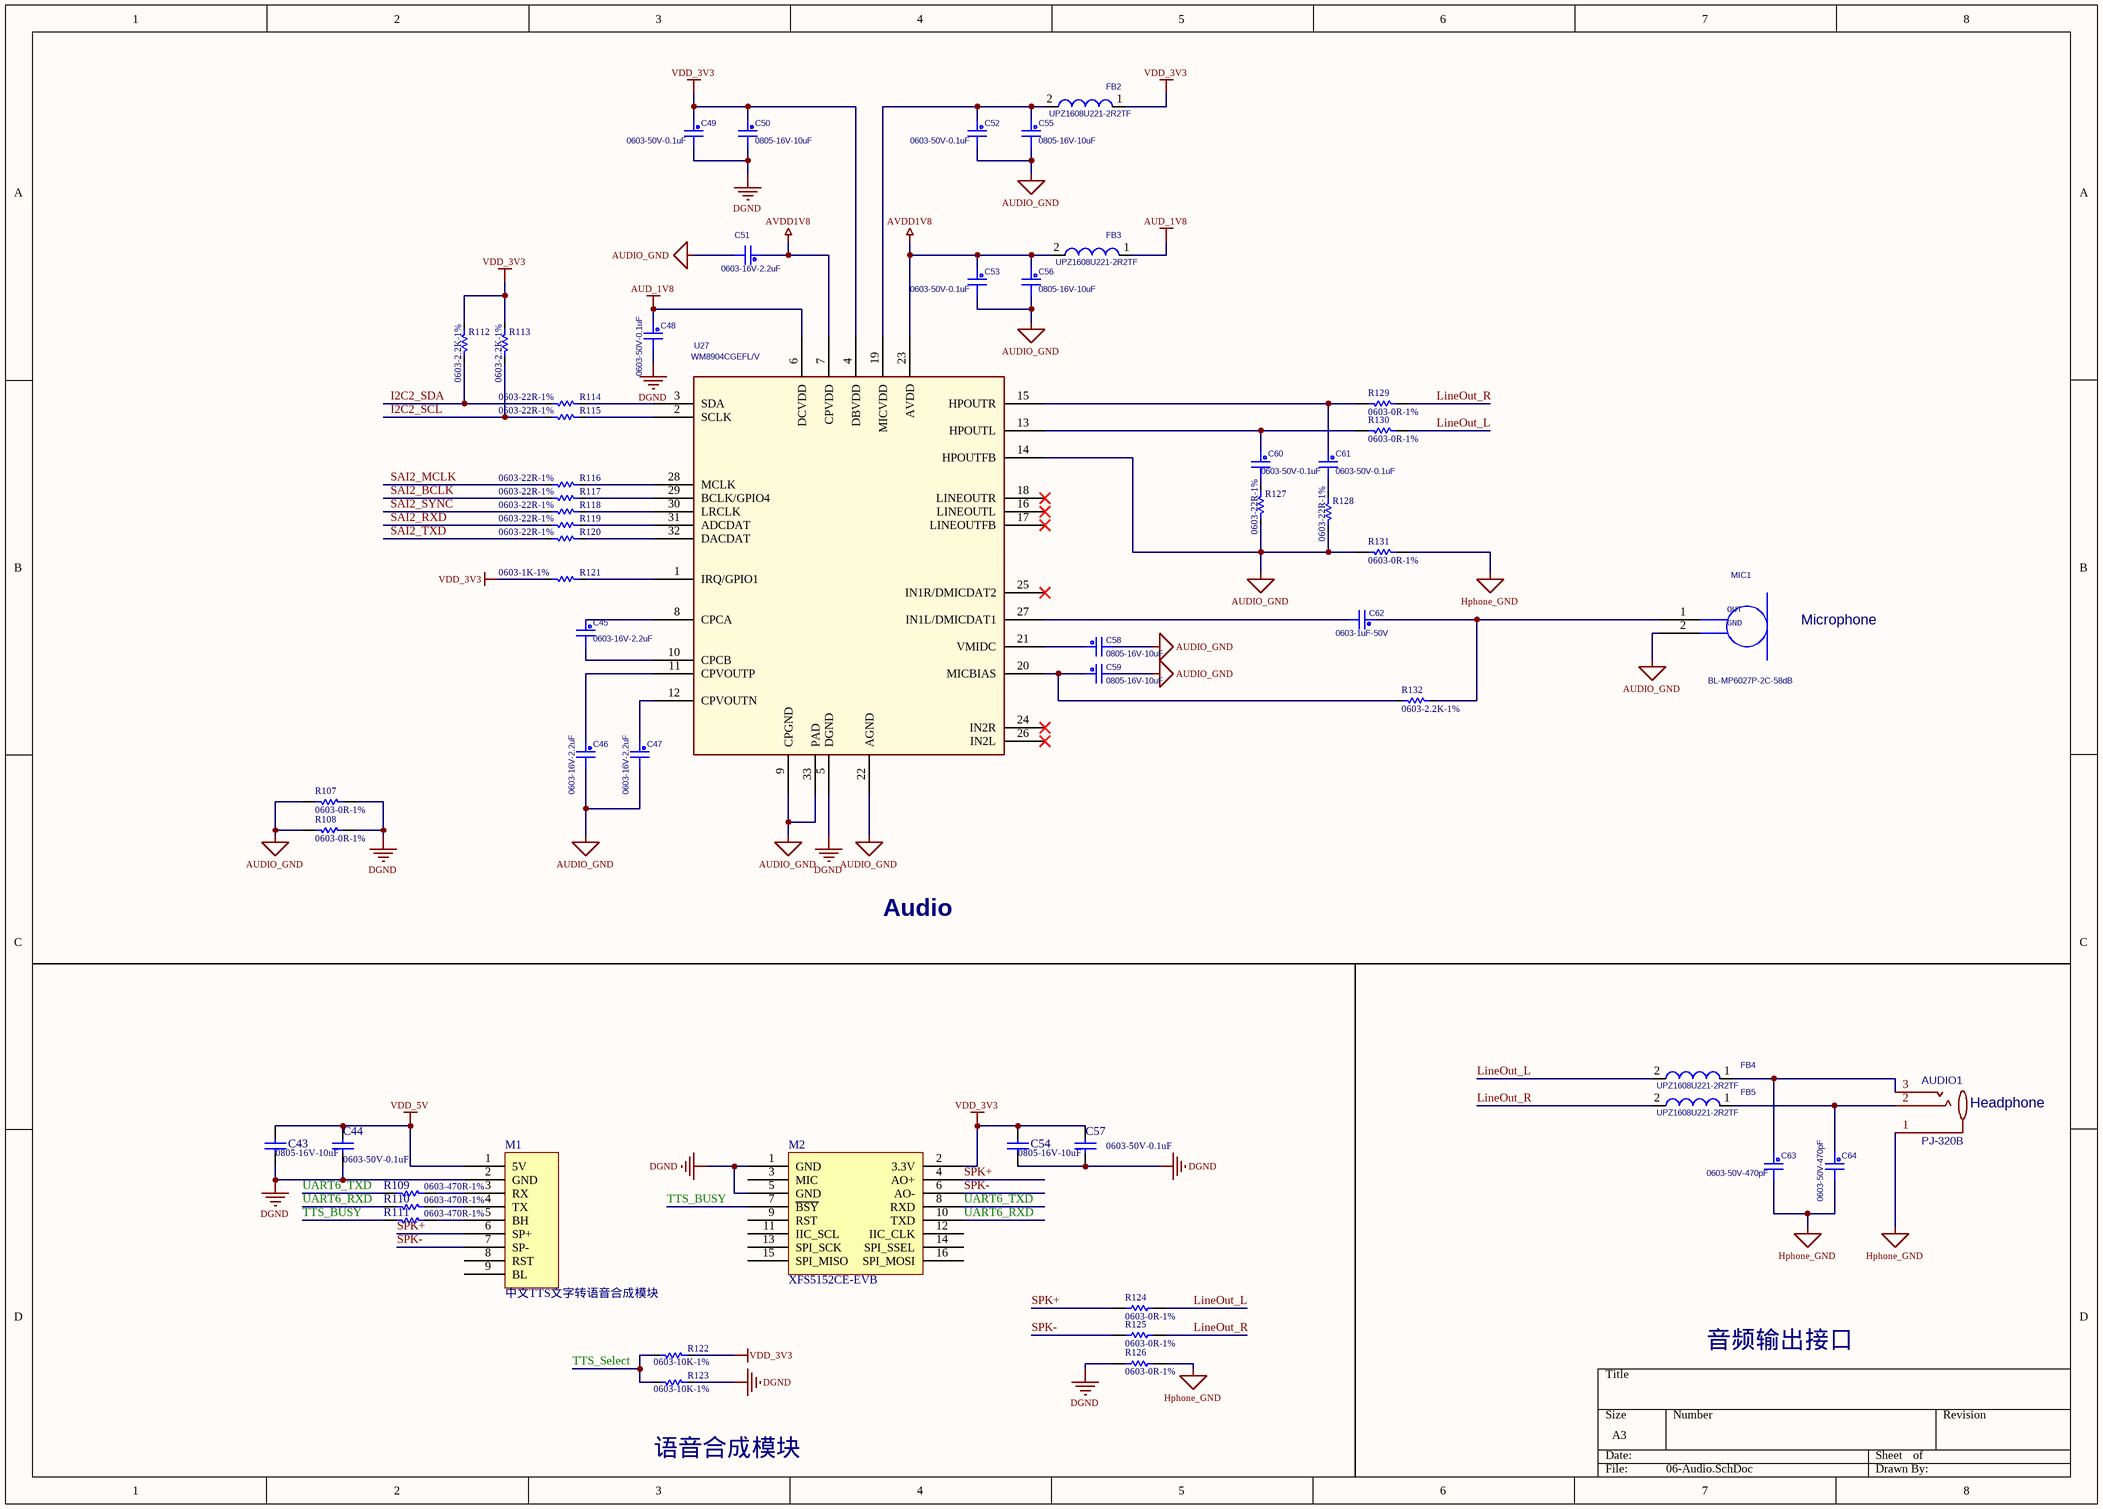
[diagram p5: 06-Audio.SchDoc]

### Parts
AUDIO1  PJ-320B  [PJ-320B]
C43  0805-16V-10uF  [0805C - 3D]
C44  0603-50V-0.1uF  [0603C]
C45  0603-16V-2.2uF  [0603C]
C46  0603-16V-2.2uF  [0603C]
C47  0603-16V-2.2uF  [0603C]
C48  0603-50V-0.1uF  [0603C]
C49  0603-50V-0.1uF  [0603C]
C50  0805-16V-10uF  [0603C]
C51  0603-16V-2.2uF  [0603C]
C52  0603-50V-0.1uF  [0603C]
C53  0603-50V-0.1uF  [0603C]
C54  0805-16V-10uF  [0805C - 3D]
C55  0805-16V-10uF  [0603C]
C56  0805-16V-10uF  [0603C]
C57  0603-50V-0.1uF  [0603C]
C58  0805-16V-10uF  [0603C]
C59  0805-16V-10uF  [0603C]
C60  0603-50V-0.1uF  [0603C]
C61  0603-50V-0.1uF  [0603C]
C62  0603-1uF-50V  [0603C]
C63  0603-50V-470pF  [0603C]
C64  0603-50V-470pF  [0603C]
FB2  UPZ1608U221-2R2TF  [0603L]
FB3  UPZ1608U221-2R2TF  [VLCF5020T]
FB4  UPZ1608U221-2R2TF  [0603L]
FB5  UPZ1608U221-2R2TF  [0603L]
M1  中文TTS文字转语音合成模块
M2  XFS5152CE-EVB  [XFS5152CE_V1.1]
MIC1  BL-MP6027P-2C-58dB  [MP6027P]
R107  0603-0R-1%  [0603R]
R108  0603-0R-1%  [0603R]
R109  0603-470R-1%  [0603R]
R110  0603-470R-1%  [0603R]
R111  0603-470R-1%  [0603R]
R112  0603-2.2K-1%  [0603R]
R113  0603-2.2K-1%  [0603R]
R114  0603-22R-1%  [0603R]
R115  0603-22R-1%  [0603R]
R116  0603-22R-1%  [0603R]
R117  0603-22R-1%  [0603R]
R118  0603-22R-1%  [0603R]
R119  0603-22R-1%  [0603R]
R120  0603-22R-1%  [0603R]
R121  0603-1K-1%  [0603R]
R122  0603-10K-1%  [0603R]
R123  0603-10K-1%  [0603R]
R124  0603-0R-1%  [0603R]
R125  0603-0R-1%  [0603R]
R126  0603-0R-1%  [0603R]
R127  0603-22R-1%  [0603R]
R128  0603-22R-1%  [0603R]
R129  0603-0R-1%  [0603R]
R130  0603-0R-1%  [0603R]
R131  0603-0R-1%  [0603R]
R132  0603-2.2K-1%  [0603R]
U27  WM8904CGEFL/V  [qfn32-0_4]

### Nets
AUD_1V8: C48.1 FB3.1 U27.6(DCVDD)
AUDIO_GND: C46.2 C47.2 C51.2 C52.2 C53.2 C55.2 C56.2 C58.2 C59.2 MIC1.2(GND) R107.1 R108.1 R127.1 R128.1 R131.1 U27.9(CPGND) U27.14(HPOUTFB) U27.22(AGND) U27.33(PAD)
AVDD1V8: C51.1 C53.1 C56.1 FB3.2 U27.7(CPVDD) U27.23(AVDD)
DGND: C43.2 C44.2 C48.2 C49.2 C50.2 C54.2 C57.2 M1.2(GND) M2.1(GND) M2.5(GND) R107.2 R108.2 R123.2 R126.2 U27.5(DGND)
Hphone_GND: AUDIO1.1 C63.2 C64.2 R126.1 R131.2
VDD_3V3: C49.1 C50.1 C54.1 C57.1 FB2.1 M2.2(3.3V) R112.2 R113.2 R121.1 R122.2 U27.4(DBVDD)
VDD_5V: C43.1 C44.1 M1.1(5V)
I2C2_SCL: R113.1 R115.1
I2C2_SDA: R112.1 R114.1
LineOut_L: FB4.2 R124.1 R130.2
LineOut_R: FB5.2 R125.1 R129.2
SAI2_BCLK: R117.1
SAI2_MCLK: R116.1
SAI2_RXD: R119.1
SAI2_SYNC: R118.1
SAI2_TXD: R120.1
SPK+: M1.6(SP+) M2.4(AO+) R124.2
SPK-: M1.7(SP-) M2.6(AO-) R125.2
TTS_BUSY: M2.7(~{BSY}) R111.2  [project net CSI_HSYNC]
TTS_Select: R122.1 R123.1  [project net CSI_VSYNC]
UART6_RXD: M2.10(TXD) R110.2  [project net CSI_PIXCLK]
UART6_TXD: M2.8(RXD) R109.2  [project net CSI_MCLK]
NetAUDIO1_2: AUDIO1.2 C64.1 FB5.1
NetAUDIO1_3: AUDIO1.3 C63.1 FB4.1
NetC45_1: C45.1 U27.8(CPCA)
NetC45_2: C45.2 U27.10(CPCB)
NetC46_1: C46.1 U27.11(CPVOUTP)
NetC47_1: C47.1 U27.12(CPVOUTN)
NetC52_1: C52.1 C55.1 FB2.2 U27.19(MICVDD)
NetC58_1: C58.1 U27.21(VMIDC)
NetC59_1: C59.1 R132.2 U27.20(MICBIAS)
NetC60_1: C60.1 R130.1 U27.13(HPOUTL)
NetC60_2: C60.2 R127.2
NetC61_1: C61.1 R129.1 U27.15(HPOUTR)
NetC61_2: C61.2 R128.2
NetC62_1: C62.1 MIC1.1(OUTPUT) R132.1
NetC62_2: C62.2 U27.27(IN1L/DMICDAT1)
NetM1_3: M1.3(RX) R109.1
NetM1_4: M1.4(TX) R110.1
NetM1_5: M1.5(BH) R111.1
NetR114_2: R114.2 U27.3(SDA)
NetR115_2: R115.2 U27.2(SCLK)
NetR116_2: R116.2 U27.28(MCLK)
NetR117_2: R117.2 U27.29(BCLK/GPIO4)
NetR118_2: R118.2 U27.30(LRCLK)
NetR119_2: R119.2 U27.31(ADCDAT)
NetR120_2: R120.2 U27.32(DACDAT)
NetR121_2: R121.2 U27.1(IRQ/GPIO1)

Not connected (* = marked no-connect by the designer): M1 8(RST) 9(BL); M2 3(MIC) 9(RST) 11(IIC_SCL) 12(IIC_CLK) 13(SPI_SCK) 14(SPI_SSEL) 15(SPI_MISO) 16(SPI_MOSI); U27 16(LINEOUTL)* 17(LINEOUTFB)* 18(LINEOUTR)* 24(IN2R)* 25(IN1R/DMICDAT2)* 26(IN2L)*

### Notes on the sheet
- Microphone
- Audio
- (near AUDIO1) Headphone
- 音频输出接口
- 语音合成模块
- (in symbol MIC) OUT

### Library data of the parts
AUDIO1 = (no symbol name): BOM_Manufacturer: BOOMELE; Contributor: LCSC; BOM_Supplier: LCSC; BOM_Manufacturer Part: PJ-320B; BOM_Supplier Part: C18594; spicePre: A
C43 C54 = Cap: Capacitor; Value: 10nF; Published: 8-Jun-2000; Revision: July-2002: Re-released for DXP Platform.; Publisher: Altium Limited
C44 C57 = Cap: Capacitor; Published: 8-Jun-2000; LatestRevisionDate: 17-Jul-2002; LatestRevisionNote: Re-released for DXP Platform.; PackageReference: RAD-0.3; Publisher: Altium Limited; Value: 0603-50V-0.1UF
C45-C53 C55 C56 C58-C64 = CERAMIC CAPACITOR: Ceramic Capacitor, +/-10%,X7R,SMD; Manufacturer: Murata; Manufacturer P/N: GRM31CR61C226KE15L; Myir P/N: 2040100002; Reserve Value: 22uF; Part Type: Ceramic Capacitor; Datasheet: Ceramic Capacitor.pdf
FB2 = Inductor_Dup1: Ferrite Bead,220R@100Mhz, 2000mA,+/-25%,SMD,0603; Manufacturer P/N: BLM21PG221SN1D; Manufacturer: Murata; Reserve Value: 220R; Myir P/N: 2060100003; Datasheet: BLM21P.pdf; Part Type: Ferrite Bead
FB3-FB5 = Inductor_Dup1: Ferrite Bead,220R@100Mhz, 2000mA,+/-25%,SMD,0805; Manufacturer P/N: BLM21PG221SN1D; Manufacturer: Murata; Reserve Value: 220R; Myir P/N: 2060100003; Datasheet: BLM21P.pdf; Part Type: Ferrite Bead
M1 = 中文TTS文字转语音合成模块: 中文TTS文字转语音合成模块,替代SYN6288和XFS5152
M2 = XFS5152CE-EVB: 科大讯飞语音合成模块 XFS5152CE-V1.1
MIC1 = MIC: Microphone Signal to noise ration　≥58　Dimensionφ6.0x2.7; Manufacturer: HUALIAN; Myir P/N: 2130300001; Datasheet: BL-MP6027P-2C-58dB.pdf; Reserve Value: BL-MP6027P-2C-58dB; Manufacturer P/N: BL-MP6027P-2C-58dB; Part Type: Connector
R107 R108 R112-R132 = Res1: Resistor; Value: 1K; Published: 8-Jun-2000; LatestRevisionDate: 17-Jul-2002; LatestRevisionNote: Re-released for DXP Platform.; PackageReference: AXIAL-0.3; Publisher: Altium Limited
R109-R111 = Res1: Resistor; Value: 0603-10K-1%; Published: 8-Jun-2000; LatestRevisionDate: 17-Jul-2002; LatestRevisionNote: Re-released for DXP Platform.; PackageReference: AXIAL-0.3; Publisher: Altium Limited
U27 = WM8904: IC,Ultra Low Power CODEC for Portable Audio Applications,SMD,QFN-32; Manufacturer: Wolfson; Myir P/N: 2010700025; Reserve Value: WM8904CGEFL/V; Manufacturer P/N: WM8904CGEFL/V; Part Type: Interface; Datasheet: WM8904.pdf

## Sheet 07-NET.SchDoc
size A4
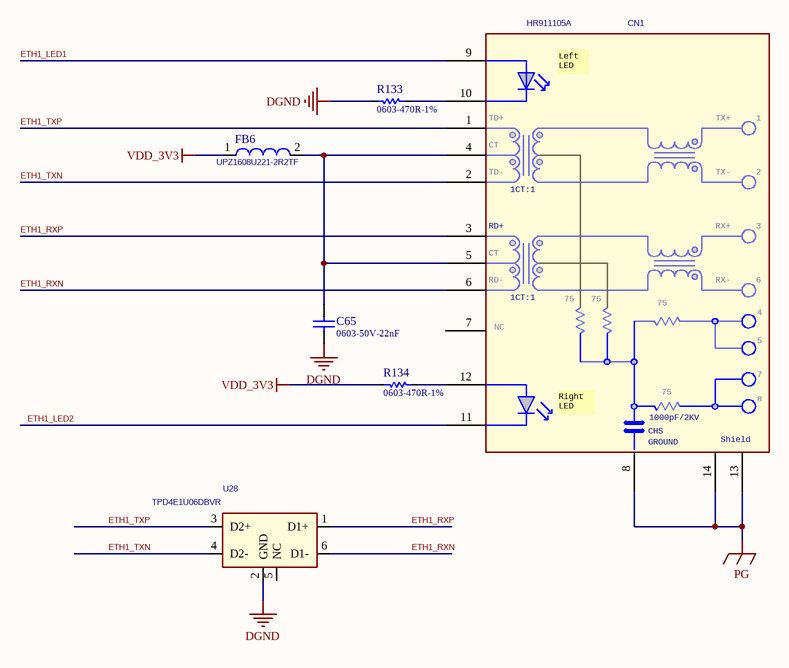
[diagram p6: 07-NET.SchDoc]

### Parts
C65  0603-50V-22nF  [0603C]
CN1  HR911105A  [HY911105A]
FB6  UPZ1608U221-2R2TF  [0603L]
R133  0603-470R-1%  [0603R]
R134  0603-470R-1%  [0603R]
U28  TPD4E1U06DBVR  [LC-SOT-23-6]

### Nets
DGND: C65.2 R133.1 U28.2(GND)
PG: CN1.8(P8) CN1.13(S1) CN1.14(S2)
VDD_3V3: FB6.1 R134.1
ETH1_LED1: CN1.9(LLED+)
ETH1_LED2: CN1.11(RLED-)
ETH1_RXN: CN1.6(P6) U28.6(D1-)
ETH1_RXP: CN1.3(P3) U28.1(D1+)
ETH1_TXN: CN1.2(P2) U28.4(D2-)
ETH1_TXP: CN1.1(P1) U28.3(D2+)
NetC65_1: C65.1 CN1.4(P4) CN1.5(P5) FB6.2
NetCN1_10: CN1.10(LLED-) R133.2
NetCN1_12: CN1.12(RLED+) R134.2

Not connected (* = marked no-connect by the designer): CN1 7(P7); U28 5(NC)

### Notes on the sheet
- (in symbol HR911105A) Left / LED; TD+; TX+; CT; TD-; TX-; 1CT:1; RD+; RX+; RD-; RX-; 75; NC; Right / LED; 1000pF/2KV; CHS; GROUND; Shield

### Library data of the parts
C65 = Cap: Capacitor; Value: 10nF; Published: 8-Jun-2000; Revision: July-2002: Re-released for DXP Platform.; Publisher: Altium Limited
CN1 = HR911105A: Connector,RJ45 Jack with integrated magnetics and leds,Right Angle,10/100M, bottom contact,white,DIP; Manufacturer: HanRun; Myir P/N: 2111800001; Part Type: Connector; Manufacturer P/N: HR911105A; Reserve Value: HR911105A; Datasheet: HR911105A.pdf
FB6 = FER_BEAD: CLASS: DISCRETE
R133 R134 = Res1: Resistor; Value: 1K; Published: 8-Jun-2000; LatestRevisionDate: 17-Jul-2002; LatestRevisionNote: Re-released for DXP Platform.; PackageReference: AXIAL-0.3; Publisher: Altium Limited
U28 = TPD4E1U06DBVR: IC,ESD Suppressor Diode Arrays ±15KV 6-Pin SOT-23; Manufacturer: TI; Myir P/N: 2011400006; Part Type: IC; Manufacturer P/N: TPD4E1U06DBVR; Reserve Value: TPD4E1U06DBVR

## Sheet 08-USB&TF.SchDoc
size A4
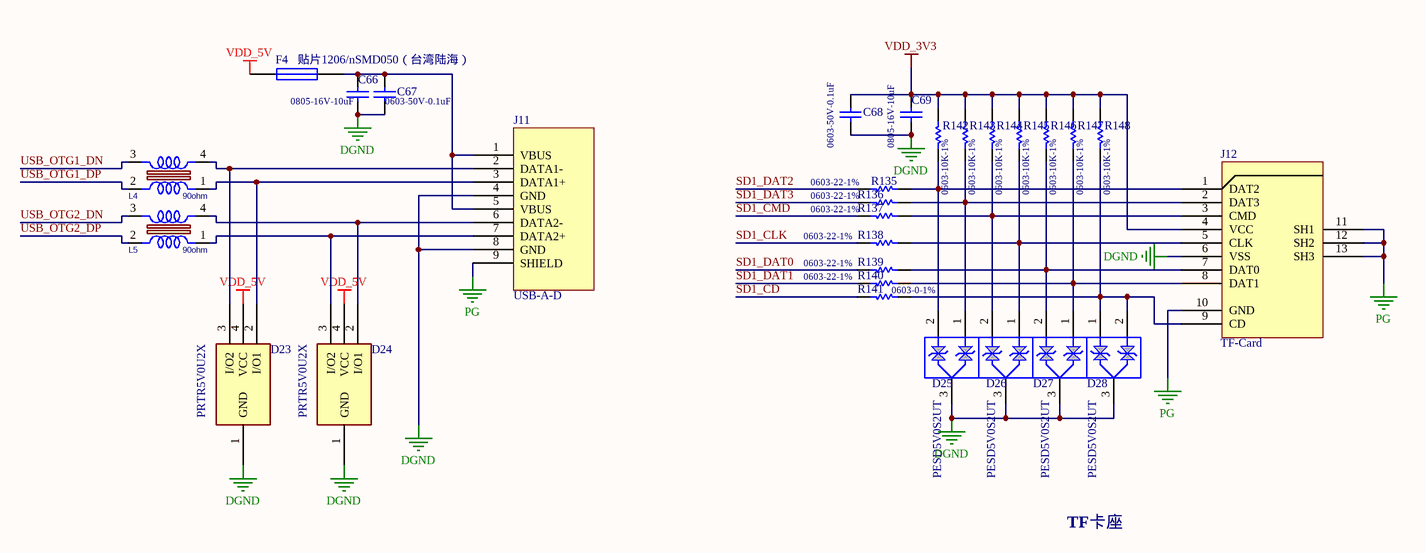
[diagram p7: 08-USB&TF.SchDoc]

### Parts
C66  0805-16V-10uF  [0805C]
C67  0603-50V-0.1uF  [0603C]
C68  0603-50V-0.1uF  [0603C]
C69  0805-16V-10uF  [0805C]
D23  PRTR5V0U2X  [SOT-143]
D24  PRTR5V0U2X  [SOT-143]
D25  PESD5V0S2UT  [SOT-23]
D26  PESD5V0S2UT  [SOT-23]
D27  PESD5V0S2UT  [SOT-23]
D28  PESD5V0S2UT  [SOT-23]
F4  贴片1206/nSMD050（台湾陆海）  [1206F]
J11  USB-A-D  [USB-AF-D]
J12  TF-Card  [SDCARD-M]
L4  90ohm  [indcm-sdcw2012]
L5  90ohm  [indcm-sdcw2012]
R135  0603-22-1%  [0603R]
R136  0603-22-1%  [0603R]
R137  0603-22-1%  [0603R]
R138  0603-22-1%  [0603R]
R139  0603-22-1%  [0603R]
R140  0603-22-1%  [0603R]
R141  0603-0-1%  [0603R]
R142  0603-10K-1%  [0603R]
R143  0603-10K-1%  [0603R]
R144  0603-10K-1%  [0603R]
R145  0603-10K-1%  [0603R]
R146  0603-10K-1%  [0603R]
R147  0603-10K-1%  [0603R]
R148  0603-10K-1%  [0603R]

### Nets
DGND: C66.2 C67.2 C68.2 C69.2 D23.1(GND) D24.1(GND) D25.3 D26.3 D27.3 D28.3 J11.4(GND) J11.8(GND) J12.6(VSS)
PG: J11.9(SHIELD) J12.10(GND) J12.11(SH1) J12.12(SH2) J12.13(SH3)
VDD_3V3: C68.1 C69.1 J12.4(VCC) R142.1 R143.1 R144.1 R145.1 R146.1 R147.1 R148.1
VDD_5V: D23.4(VCC) D24.4(VCC) F4.1
SD1_CD: R141.2
SD1_CLK: R138.2
SD1_CMD: R137.2
SD1_DAT0: R139.2
SD1_DAT1: R140.2
SD1_DAT2: R135.2
SD1_DAT3: R136.2
USB_OTG1_DN: L4.3
USB_OTG1_DP: L4.2
USB_OTG2_DN: L5.3
USB_OTG2_DP: L5.2
NetC66_1: C66.1 C67.1 F4.2 J11.1(VBUS) J11.5(VBUS)
NetD23_2: D23.2(I/O1) J11.3(DATA1+) L4.1
NetD23_3: D23.3(I/O2) J11.2(DATA1-) L4.4
NetD24_2: D24.2(I/O1) J11.6(DATA2-) L5.4
NetD24_3: D24.3(I/O2) J11.7(DATA2+) L5.1
NetD25_1: D25.1 J12.2(DAT3) R136.1 R143.2
NetD25_2: D25.2 J12.1(DAT2) R135.1 R142.2
NetD26_1: D26.1 J12.5(CLK) R138.1 R145.2
NetD26_2: D26.2 J12.3(CMD) R137.1 R144.2
NetD27_1: D27.1 J12.8(DAT1) R140.1 R147.2
NetD27_2: D27.2 J12.7(DAT0) R139.1 R146.2
NetD28_1: D28.1 D28.2 J12.9(CD) R141.1 R148.2

### Notes on the sheet
- TF卡座

### Library data of the parts
C66-C69 = Cap: Capacitor; Value: 10nF; Published: 8-Jun-2000; Revision: July-2002: Re-released for DXP Platform.; Publisher: Altium Limited
D23 D24 = 1.05.10.0153: PRTR5V0U2X,SOT-143B,NXP,RoHS; 名称: IC; 设备封装名称: SOT-143B_PRTR5V0U2X; 贴片和直插: SMT; 物料代码: 1.05.10.0153; Value: PRTR5V0U2X; 封装: SOT-143B; 厂商: NXP; RoHS: RoHS; 型号: PRTR5V0U2X; ComponentLink1Description: ErpDataInfo; ComponentLink1URL: http://erp.zlgmcu.com/ErpExt/ErpData/ListMateriel.aspx?pkey=1.05.10.0153
D25-D27 = NUP2105L: TVS protect; Value: DNF
D28 = NUP2105L: TVS protect; Value: TVS
F4 = Fuse 1: Fuse; Published: 8-Jun-2000; LatestRevisionDate: 17-Jul-2002; LatestRevisionNote: Re-released for DXP Platform.; PackageReference: PIN-W2/E2.8; Publisher: Altium Limited; PackageDescription: Thru-Hole; 2 Leads
J12 = TF01A: Name: TF卡座; 封装: TF-CARD
L4 L5 = Common Choke: 共模电感; name: WCM2012F2SF-900T04; name th: SDCW2012-2-121TF; Reserve Value: 120ohm; Part Type: Common Inductor
R135-R140 = Res1: Resistor; Value: 22; Published: 8-Jun-2000; LatestRevisionDate: 17-Jul-2002; LatestRevisionNote: Re-released for DXP Platform.; PackageReference: AXIAL-0.3; Publisher: Altium Limited
R141 = Res1: Resistor; Value: 0R; Published: 8-Jun-2000; LatestRevisionDate: 17-Jul-2002; LatestRevisionNote: Re-released for DXP Platform.; PackageReference: AXIAL-0.3; Publisher: Altium Limited
R142-R148 = Res1: Resistor; Value: 10K; Published: 8-Jun-2000; LatestRevisionDate: 17-Jul-2002; LatestRevisionNote: Re-released for DXP Platform.; PackageReference: AXIAL-0.3; Publisher: Altium Limited

## Sheet 09-other.SchDoc
size A4
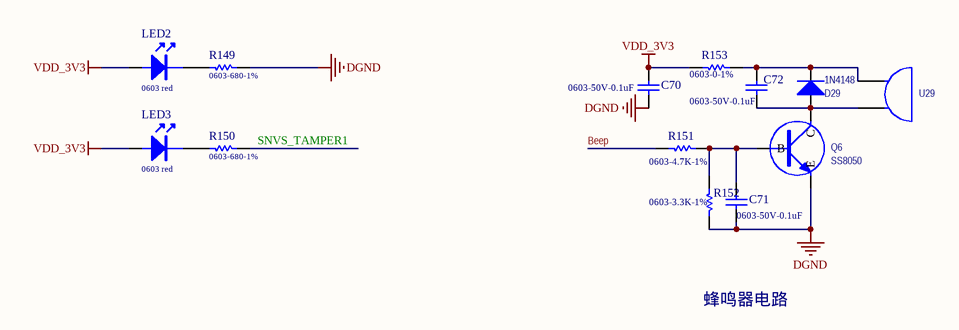
[diagram p8: 09-other.SchDoc]

### Parts
C70  0603-50V-0.1uF  [0603C]
C71  0603-50V-0.1uF  [0603C]
C72  0603-50V-0.1uF  [0603C]
D29  1N4148  [SOD-323]
LED2  0603 red  [LED_1]
LED3  0603 red  [LED_1]
Q6  SS8050  [SOT-23]
R149  0603-680-1%  [0603R]
R150  0603-680-1%  [0603R]
R151  0603-4.7K-1%  [0603R]
R152  0603-3.3K-1%  [0603R]
R153  0603-0-1%  [0603R]
U29  BUZZER  [B-12*9.5]  (value not drawn)

### Nets
DGND: C70.2 C71.2 Q6.2(E) R149.1 R152.1
VDD_3V3: C70.1 LED2.1 LED3.1 R153.2
Beep: R151.1  [project net 4G_WAKE_IN]
SNVS_TAMPER1: R150.1
NetC71_1: C71.1 Q6.1(B) R151.2 R152.2
NetC72_1: C72.1 D29.2(K) R153.1 U29.1(A)
NetC72_2: C72.2 D29.1(A) Q6.3(C) U29.2(B)
NetLED2_2: LED2.2 R149.2
NetLED3_2: LED3.2 R150.2

### Notes on the sheet
- 蜂鸣器电路

### Library data of the parts
C70-C72 = Cap: Capacitor; Value: 10nF; Published: 8-Jun-2000; Revision: July-2002: Re-released for DXP Platform.; Publisher: Altium Limited
D29 = Diode 1N4148: High Conductance Fast Diode; Published: 8-Jun-2000; LatestRevisionDate: 17-Jul-2002; LatestRevisionNote: Re-released for DXP Platform.; DatasheetVersion: 1997; PackageReference: DO-35; Publisher: Altium Limited; Code_JEDEC: DO-204-AH; ComponentLink1Description: Manufacturer Link; ComponentLink1URL: http://www.fairchildsemi.com/; ComponentLink2Description: Datasheet; ComponentLink2URL: http://www.fairchildsemi.com/ds/1N%2F1N4148.pdf
LED2 LED3 = LED: SY: POW
Q6 = NPN: NPN Transistor
R149-R153 = Res1: Resistor; Value: 1K; Published: 8-Jun-2000; LatestRevisionDate: 17-Jul-2002; LatestRevisionNote: Re-released for DXP Platform.; PackageReference: AXIAL-0.3; Publisher: Altium Limited
U29 = BUZZER: TMB12A03

## Nets that join several sheets
0V: 03-power (C23.2 R48.1 U5.3), 04-MCU (16 pins)
AUD_1V8: 03-power (C24.1 C27.1 U4.5), 06-Audio (C48.1 FB3.1 U27.6)
DGND: 01-MYB-Y6ULX (34 pins), 02-PowerIn (5 pins), 03-power (25 pins), 04-MCU (16 pins), 05-UART (19 pins), 06-Audio (15 pins), 07-NET (C65.2 R133.1 U28.2), 08-USB&TF (13 pins), 09-other (5 pins)
GND: 04-MCU (12 pins), 05-UART (D21.3 D22.3)
PG: 02-PowerIn (C3.1 C4.2), 07-NET (CN1.8 CN1.13 CN1.14), 08-USB&TF (5 pins)
V12D: 03-power (C23.1 R48.2 U5.4), 04-MCU (R51.2 R52.2 R53.2 R54.2)
VDD_3V3: 01-MYB-Y6ULX (5 pins), 03-power (6 pins), 04-MCU (22 pins), 05-UART (7 pins), 06-Audio (11 pins), 07-NET (FB6.1 R134.1), 08-USB&TF (10 pins), 09-other (C70.1 LED2.1 LED3.1 R153.2)
VDD_5V: 01-MYB-Y6ULX (C1.1 J1.1 J1.2 U1.24), 03-power (7 pins), 04-MCU (FB1.1), 06-Audio (C43.1 C44.1 M1.1), 08-USB&TF (D23.4 D24.4 F4.1)
VDD_BAT: 01-MYB-Y6ULX (U1.39), 03-power (C15.1 D3.2)
VIN: 02-PowerIn (C7.1 C8.1 D2.2 L2.2), 03-power (C9.1 C10.1 R40.1 U2.2)
4G_WAKE_IN: 01-MYB-Y6ULX (U1.7), 09-other (R151.1)
CSI_HSYNC: 01-MYB-Y6ULX (U1.138), 06-Audio (M2.7 R111.2)
CSI_MCLK: 01-MYB-Y6ULX (U1.140), 06-Audio (M2.8 R109.2)
CSI_PIXCLK: 01-MYB-Y6ULX (U1.139), 06-Audio (M2.10 R110.2)
CSI_VSYNC: 01-MYB-Y6ULX (U1.137), 06-Audio (R122.1 R123.1)
ETH1_LED1: 01-MYB-Y6ULX (U1.69), 07-NET (CN1.9)
ETH1_LED2: 01-MYB-Y6ULX (U1.70), 07-NET (CN1.11)
ETH1_RXN: 01-MYB-Y6ULX (U1.75), 07-NET (CN1.6 U28.6)
ETH1_RXP: 01-MYB-Y6ULX (U1.76), 07-NET (CN1.3 U28.1)
ETH1_TXN: 01-MYB-Y6ULX (U1.72), 07-NET (CN1.2 U28.4)
ETH1_TXP: 01-MYB-Y6ULX (U1.73), 07-NET (CN1.1 U28.3)
I2C2_SCL: 01-MYB-Y6ULX (R26.1 U1.66), 06-Audio (R113.1 R115.1)
I2C2_SDA: 01-MYB-Y6ULX (R27.1 U1.67), 06-Audio (R112.1 R114.1)
MCU_RX: 01-MYB-Y6ULX (U1.105), 04-MCU (U11.31)
MCU_TX: 01-MYB-Y6ULX (U1.106), 04-MCU (U11.30)
PMIC_ON_REQ: 01-MYB-Y6ULX (U1.3), 03-power (R45.1)
SAI2_BCLK: 01-MYB-Y6ULX (U1.18), 06-Audio (R117.1)
SAI2_MCLK: 01-MYB-Y6ULX (U1.20), 06-Audio (R116.1)
SAI2_RXD: 01-MYB-Y6ULX (U1.17), 06-Audio (R119.1)
SAI2_SYNC: 01-MYB-Y6ULX (U1.21), 06-Audio (R118.1)
SAI2_TXD: 01-MYB-Y6ULX (U1.19), 06-Audio (R120.1)
SD1_CD: 01-MYB-Y6ULX (U1.53), 08-USB&TF (R141.2)
SD1_CLK: 01-MYB-Y6ULX (U1.127), 08-USB&TF (R138.2)
SD1_CMD: 01-MYB-Y6ULX (U1.126), 08-USB&TF (R137.2)
SNVS_TAMPER1: 01-MYB-Y6ULX (U1.14), 09-other (R150.1)
UART1_CTS: 01-MYB-Y6ULX (U1.54), 05-UART (R99.1 U26.2 U26.3)
UART1_RXD: 01-MYB-Y6ULX (U1.52), 05-UART (R106.2)
UART1_TXD: 01-MYB-Y6ULX (U1.51), 05-UART (R105.2)
UART2_RXD: 01-MYB-Y6ULX (U1.56), 05-UART (U26.1)
UART2_TXD: 01-MYB-Y6ULX (U1.55), 05-UART (U26.4)
UART3_CTS: 01-MYB-Y6ULX (U1.63), 05-UART (R95.1 U24.2 U24.3)
UART3_RXD: 01-MYB-Y6ULX (U1.61), 05-UART (U25.35)
UART3_TXD: 01-MYB-Y6ULX (U1.60), 05-UART (U25.34)
UART4_RXD: 01-MYB-Y6ULX (U1.65), 05-UART (U24.1)
UART4_TXD: 01-MYB-Y6ULX (U1.64), 05-UART (U24.4)
USB_OTG1_DN: 01-MYB-Y6ULX (U1.30), 08-USB&TF (L4.3)
USB_OTG1_DP: 01-MYB-Y6ULX (U1.31), 08-USB&TF (L4.2)
USB_OTG2_DN: 01-MYB-Y6ULX (U1.28), 08-USB&TF (L5.3)
USB_OTG2_DP: 01-MYB-Y6ULX (U1.27), 08-USB&TF (L5.2)
WLAN_PWR: 01-MYB-Y6ULX (U1.22), 05-UART (C37.1 R93.2)